# Altium project Motherboard.PrjPcb
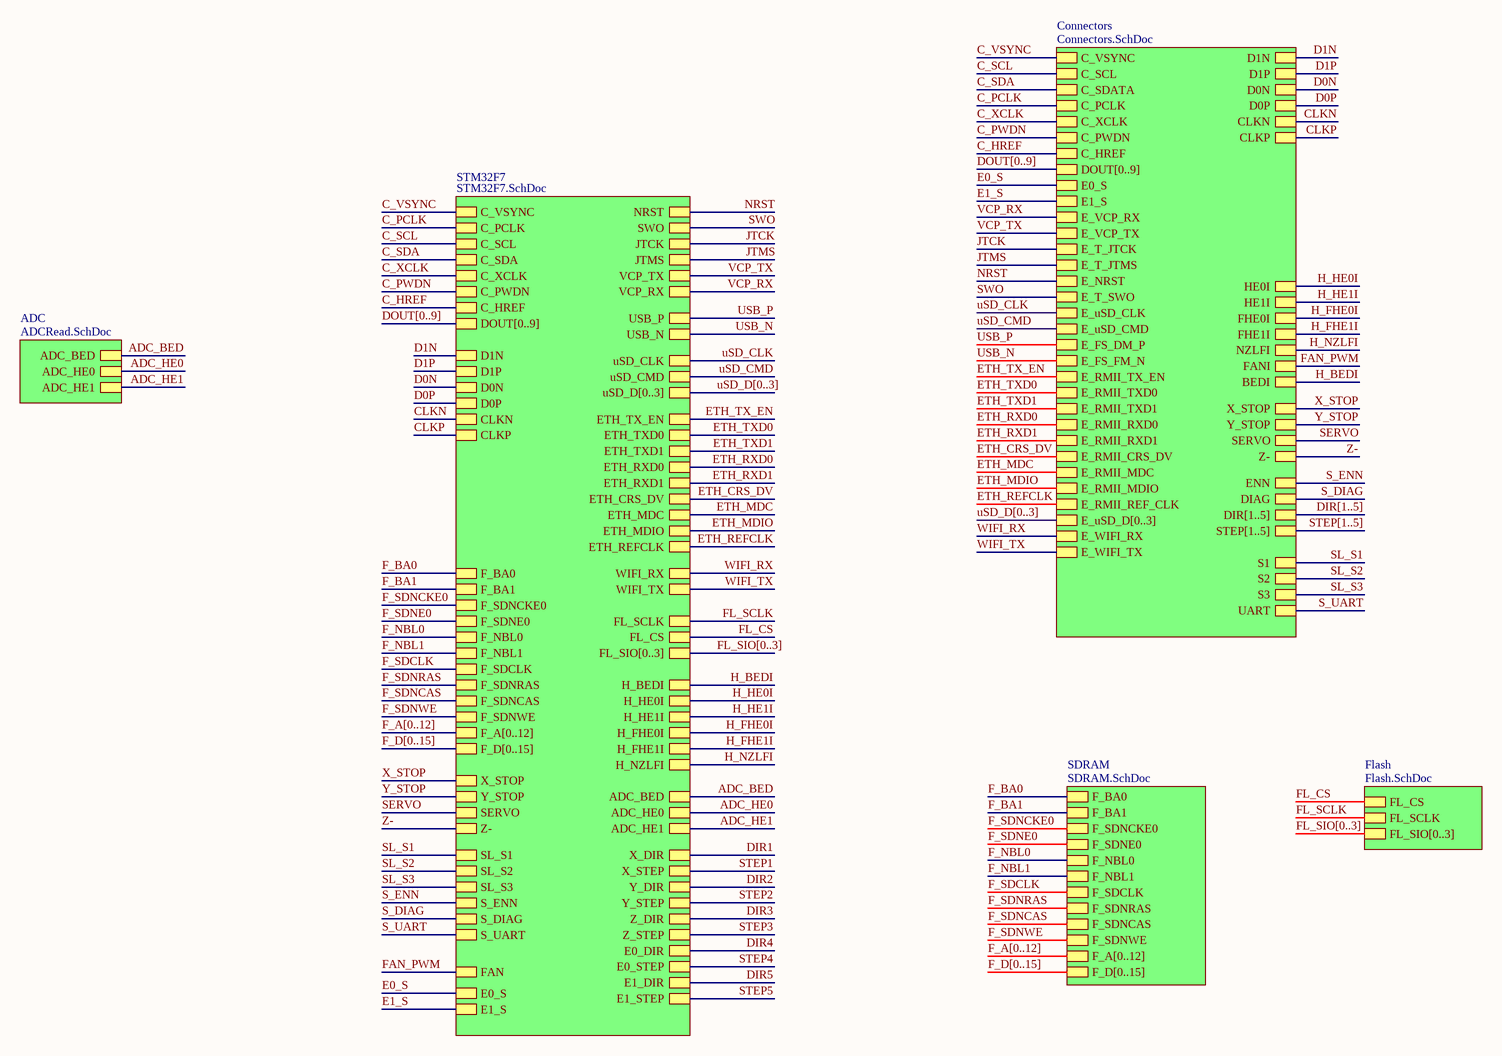
[diagram p0: Motherboard.SchDoc]
6 sheets, 89 parts. Net scope: hierarchical (ports join the sheet entries above them; power ports are global).
Sheets:
  Motherboard.SchDoc
    Connectors = Connectors.SchDoc
    STM32F7 = STM32F7.SchDoc
    SDRAM = SDRAM.SchDoc
    Flash = Flash.SchDoc
    ADC = ADCRead.SchDoc

## Sheet Motherboard.SchDoc
size B

### Sub-sheets
ADC = ADCRead.SchDoc: ADC_BED, ADC_HE0, ADC_HE1
Connectors = Connectors.SchDoc: C_VSYNC, C_SCL, C_SDATA, C_PCLK, C_XCLK, C_PWDN, C_HREF, DOUT[0..9], E_VCP_RX, E_VCP_TX, E_T_JTCK, E_T_JTMS, E_NRST, E_T_SWO, E_uSD_CLK, E_uSD_CMD, E_FS_DM_P, E_FS_FM_N, E_RMII_TX_EN, E_RMII_TXD0, E_RMII_TXD1, E_RMII_RXD0, E_RMII_RXD1, E_RMII_CRS_DV, E_RMII_MDC, E_RMII_MDIO, E_RMII_REF_CLK, E_uSD_D[0..3], E_WIFI_RX, E_WIFI_TX, X_STOP, Y_STOP, SERVO, Z-, E0_S, E1_S, BEDI, FANI, FHE1I, HE1I, FHE0I, NZLFI, HE0I, ENN, STEP[1..5], DIR[1..5], DIAG, UART, S1, S2, S3, D1N, D1P, D0N, D0P, CLKN, CLKP
Flash = Flash.SchDoc: FL_CS, FL_SCLK, FL_SIO[0..3]
SDRAM = SDRAM.SchDoc: F_BA0, F_BA1, F_SDNCKE0, F_SDNE0, F_NBL0, F_NBL1, F_SDCLK, F_SDNRAS, F_SDNCAS, F_SDNWE, F_A[0..12], F_D[0..15]
STM32F7 = STM32F7.SchDoc: NRST, SWO, JTCK, JTMS, VCP_TX, VCP_RX, USB_P, USB_N, uSD_CLK, uSD_CMD, uSD_D[0..3], ETH_TX_EN, ETH_TXD0, ETH_TXD1, ETH_RXD0, ETH_RXD1, ETH_CRS_DV, ETH_MDC, ETH_MDIO, ETH_REFCLK, WIFI_RX, WIFI_TX, C_VSYNC, C_PCLK, C_SCL, C_SDA, C_XCLK, C_PWDN, C_HREF, DOUT[0..9], F_BA0, F_BA1, F_SDNCKE0, F_SDNE0, F_NBL0, F_NBL1, F_SDCLK, F_SDNRAS, F_SDNCAS, F_SDNWE, F_A[0..12], F_D[0..15], FL_SCLK, FL_CS, FL_SIO[0..3], H_BEDI, H_HE0I, H_HE1I, H_FHE0I, H_FHE1I, H_NZLFI, ADC_BED, ADC_HE0, ADC_HE1, X_STOP, Y_STOP, SERVO, Z-, SL_S1, SL_S2, SL_S3, S_ENN, S_DIAG, S_UART, X_DIR, X_STEP, Y_DIR, Y_STEP, Z_DIR, Z_STEP, E0_DIR, E0_STEP, E1_DIR, E1_STEP, FAN, E0_S, E1_S, D1N, D1P, D0N, D0P, CLKN, CLKP

### Nets
ADC_BED: sheet STM32F7/ADC_BED, sheet ADC/ADC_BED
ADC_HE0: sheet STM32F7/ADC_HE0, sheet ADC/ADC_HE0
ADC_HE1: sheet STM32F7/ADC_HE1, sheet ADC/ADC_HE1
C_HREF: sheet Connectors/C_HREF, sheet STM32F7/C_HREF
C_PCLK: sheet Connectors/C_PCLK, sheet STM32F7/C_PCLK
C_PWDN: sheet Connectors/C_PWDN, sheet STM32F7/C_PWDN
C_SCL: sheet Connectors/C_SCL, sheet STM32F7/C_SCL
C_SDA: sheet Connectors/C_SDATA, sheet STM32F7/C_SDA
C_VSYNC: sheet Connectors/C_VSYNC, sheet STM32F7/C_VSYNC
C_XCLK: sheet Connectors/C_XCLK, sheet STM32F7/C_XCLK
CLKN: sheet Connectors/CLKN, sheet STM32F7/CLKN
CLKP: sheet Connectors/CLKP, sheet STM32F7/CLKP
D0N: sheet Connectors/D0N, sheet STM32F7/D0N
D0P: sheet Connectors/D0P, sheet STM32F7/D0P
D1N: sheet Connectors/D1N, sheet STM32F7/D1N
D1P: sheet Connectors/D1P, sheet STM32F7/D1P
E0_S: sheet Connectors/E0_S, sheet STM32F7/E0_S
E1_S: sheet Connectors/E1_S, sheet STM32F7/E1_S
ETH_CRS_DV: sheet Connectors/E_RMII_CRS_DV, sheet STM32F7/ETH_CRS_DV
ETH_MDC: sheet Connectors/E_RMII_MDC, sheet STM32F7/ETH_MDC
ETH_MDIO: sheet Connectors/E_RMII_MDIO, sheet STM32F7/ETH_MDIO
ETH_REFCLK: sheet Connectors/E_RMII_REF_CLK, sheet STM32F7/ETH_REFCLK
ETH_RXD0: sheet Connectors/E_RMII_RXD0, sheet STM32F7/ETH_RXD0
ETH_RXD1: sheet Connectors/E_RMII_RXD1, sheet STM32F7/ETH_RXD1
ETH_TX_EN: sheet Connectors/E_RMII_TX_EN, sheet STM32F7/ETH_TX_EN
ETH_TXD0: sheet Connectors/E_RMII_TXD0, sheet STM32F7/ETH_TXD0
ETH_TXD1: sheet Connectors/E_RMII_TXD1, sheet STM32F7/ETH_TXD1
F_BA0: sheet STM32F7/F_BA0, sheet SDRAM/F_BA0
F_BA1: sheet STM32F7/F_BA1, sheet SDRAM/F_BA1
F_NBL0: sheet STM32F7/F_NBL0, sheet SDRAM/F_NBL0
F_NBL1: sheet STM32F7/F_NBL1, sheet SDRAM/F_NBL1
F_SDCLK: sheet STM32F7/F_SDCLK, sheet SDRAM/F_SDCLK
F_SDNCAS: sheet STM32F7/F_SDNCAS, sheet SDRAM/F_SDNCAS
F_SDNCKE0: sheet STM32F7/F_SDNCKE0, sheet SDRAM/F_SDNCKE0
F_SDNE0: sheet STM32F7/F_SDNE0, sheet SDRAM/F_SDNE0
F_SDNRAS: sheet STM32F7/F_SDNRAS, sheet SDRAM/F_SDNRAS
F_SDNWE: sheet STM32F7/F_SDNWE, sheet SDRAM/F_SDNWE
FAN_PWM: sheet Connectors/FANI, sheet STM32F7/FAN
FL_CS: sheet STM32F7/FL_CS, sheet Flash/FL_CS  [project net CS]
FL_SCLK: sheet STM32F7/FL_SCLK, sheet Flash/FL_SCLK
H_BEDI: sheet Connectors/BEDI, sheet STM32F7/H_BEDI
H_FHE0I: sheet Connectors/FHE0I, sheet STM32F7/H_FHE0I
H_FHE1I: sheet Connectors/FHE1I, sheet STM32F7/H_FHE1I
H_HE0I: sheet Connectors/HE0I, sheet STM32F7/H_HE0I
H_HE1I: sheet Connectors/HE1I, sheet STM32F7/H_HE1I
H_NZLFI: sheet Connectors/NZLFI, sheet STM32F7/H_NZLFI
JTCK: sheet Connectors/E_T_JTCK, sheet STM32F7/JTCK
JTMS: sheet Connectors/E_T_JTMS, sheet STM32F7/JTMS
NRST: sheet Connectors/E_NRST, sheet STM32F7/NRST
S_DIAG: sheet Connectors/DIAG, sheet STM32F7/S_DIAG
S_ENN: sheet Connectors/ENN, sheet STM32F7/S_ENN
S_UART: sheet Connectors/UART, sheet STM32F7/S_UART
SERVO: sheet Connectors/SERVO, sheet STM32F7/SERVO
SL_S1: sheet Connectors/S1, sheet STM32F7/SL_S1
SL_S2: sheet Connectors/S2, sheet STM32F7/SL_S2
SL_S3: sheet Connectors/S3, sheet STM32F7/SL_S3
SWO: sheet Connectors/E_T_SWO, sheet STM32F7/SWO
USB_N: sheet Connectors/E_FS_FM_N, sheet STM32F7/USB_N  [project net FS_DM_N]
USB_P: sheet Connectors/E_FS_DM_P, sheet STM32F7/USB_P  [project net FS_DM_P]
uSD_CLK: sheet Connectors/E_uSD_CLK, sheet STM32F7/uSD_CLK
uSD_CMD: sheet Connectors/E_uSD_CMD, sheet STM32F7/uSD_CMD
VCP_RX: sheet Connectors/E_VCP_RX, sheet STM32F7/VCP_RX  [project net USART1_RX]
VCP_TX: sheet Connectors/E_VCP_TX, sheet STM32F7/VCP_TX  [project net USART1_TX]
WIFI_RX: sheet Connectors/E_WIFI_RX, sheet STM32F7/WIFI_RX
WIFI_TX: sheet Connectors/E_WIFI_TX, sheet STM32F7/WIFI_TX
X_STOP: sheet Connectors/X_STOP, sheet STM32F7/X_STOP
Y_STOP: sheet Connectors/Y_STOP, sheet STM32F7/Y_STOP
Z-: sheet Connectors/Z-, sheet STM32F7/Z-

### Buses and harness runs
bus DIR[1..5] = sheet Connectors/DIR[1..5]
bus DOUT[0..9] = sheet Connectors/DOUT[0..9]
bus DOUT[0..9] = sheet STM32F7/DOUT[0..9]
bus F_A[0..12] = sheet SDRAM/F_A[0..12]
bus F_A[0..12] = sheet STM32F7/F_A[0..12]
bus F_D[0..15] = sheet SDRAM/F_D[0..15]
bus F_D[0..15] = sheet STM32F7/F_D[0..15]
bus FL_SIO[0..3] = sheet Flash/FL_SIO[0..3]
bus FL_SIO[0..3] = sheet STM32F7/FL_SIO[0..3]
bus STEP[1..5] = sheet Connectors/STEP[1..5]
bus uSD_D[0..3] = sheet Connectors/E_uSD_D[0..3]
bus uSD_D[0..3] = sheet STM32F7/uSD_D[0..3]

## Sheet Connectors.SchDoc
size B
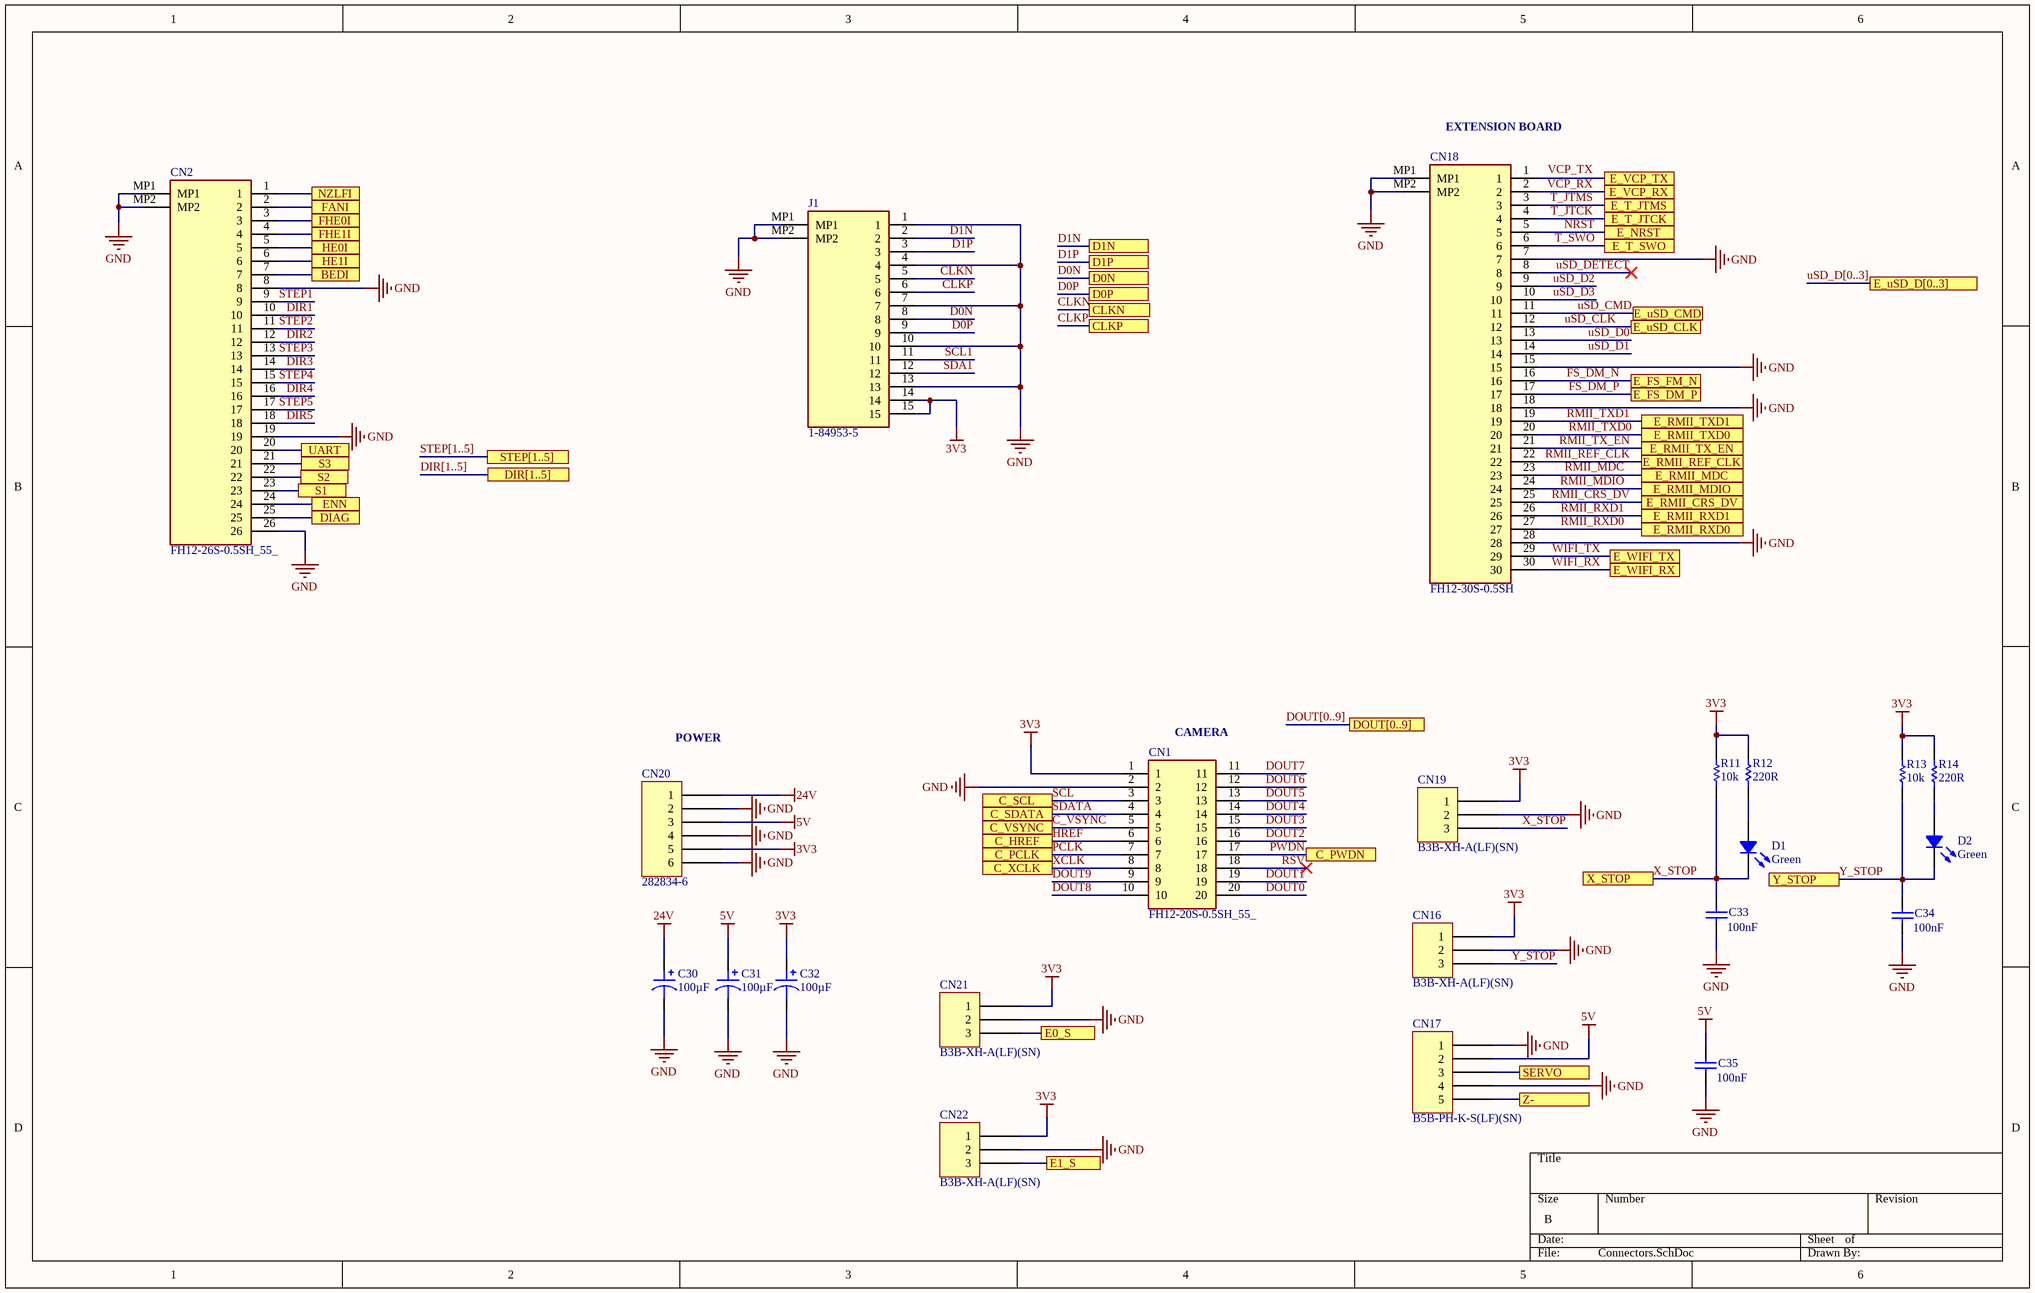
[diagram p1: Connectors.SchDoc]

### Parts
C30  100µF  [CAP ALSMD POLY 5.3MM H6.0MM]
C31  100µF  [CAP ALSMD POLY 5.3MM H6.0MM]
C32  100µF  [CAP ALSMD POLY 5.3MM H6.0MM]
C33  value 100nF  [1608[0603]]  (hidden comment: X5R)
C34  value 100nF  [1608[0603]]  (hidden comment: X5R)
C35  value 100nF  [1608[0603]]  (hidden comment: X5R)
CN1  FH12-20S-0.5SH_55_  [FH12-20S-0.5SH(55)]
CN2  FH12-26S-0.5SH_55_  [FH1226S05SH55]
CN16  B3B-XH-A(LF)(SN)  [JST XH B3B-XH-A]
CN17  B5B-PH-K-S(LF)(SN)  [JST B5B-PH-K]
CN18  FH12-30S-0.5SH  [FH1230S05SH]
CN19  B3B-XH-A(LF)(SN)  [JST XH B3B-XH-A]
CN20  282834-6  [TE 282834-6]
CN21  B3B-XH-A(LF)(SN)  [JST XH B3B-XH-A]
CN22  B3B-XH-A(LF)(SN)  [JST XH B3B-XH-A]
D1  Green  [LED 0805_2012 GREEN]
D2  Green  [LED 0805_2012 GREEN]
J1  1-84953-5  [1849535]
R11  value 10k  [1608[0603]]  (hidden comment: Res1)
R12  value 220R  [1608[0603]]  (hidden comment: Res1)
R13  value 10k  [1608[0603]]  (hidden comment: Res1)
R14  value 220R  [1608[0603]]  (hidden comment: Res1)

### Ports
BEDI, C_HREF, C_PCLK, C_PWDN, C_SCL, C_SDATA, C_VSYNC, C_XCLK, CLKN, CLKP, D0N, D0P, D1N, D1P, DIAG, DIR[1..5], DOUT[0..9], E0_S, E1_S, E_FS_DM_P, E_FS_FM_N, E_NRST, E_RMII_CRS_DV, E_RMII_MDC, E_RMII_MDIO, E_RMII_REF_CLK, E_RMII_RXD0, E_RMII_RXD1, E_RMII_TX_EN, E_RMII_TXD0, E_RMII_TXD1, E_T_JTCK, E_T_JTMS, E_T_SWO, E_uSD_CLK, E_uSD_CMD, E_uSD_D[0..3], E_VCP_RX, E_VCP_TX, E_WIFI_RX, E_WIFI_TX, ENN, FANI, FHE0I, FHE1I, HE0I, HE1I, NZLFI, S1, S2, S3, SERVO, STEP[1..5], UART, X_STOP, Y_STOP, Z-

### Nets
3V3: C32.1 CN1.1 CN16.1 CN19.1 CN20.5 CN21.1 CN22.1 J1.14 J1.15 R11.1 R12.1 R13.1 R14.1
5V: C31.1 C35.1 CN17.2 CN20.3
24V: C30.1 CN20.1
GND: C30.2 C31.2 C32.2 C33.2 C34.2 C35.2 CN1.2 CN2.8 CN2.19 CN2.26 CN2.MP1 CN2.MP2 CN16.2 CN17.1 CN17.4 CN18.7 CN18.15 CN18.18 CN18.28 CN18.MP1 CN18.MP2 CN19.2 CN20.2 CN20.4 CN20.6 CN21.2 CN22.2 J1.1 J1.4 J1.7 J1.10 J1.13 J1.MP1 J1.MP2
C_VSYNC: CN1.5 ; port C_VSYNC
CLKN: J1.5 ; port CLKN
CLKP: J1.6 ; port CLKP
D0N: J1.8 ; port D0N
D0P: J1.9 ; port D0P
D1N: J1.2 ; port D1N
D1P: J1.3 ; port D1P
DIR1: CN2.10
DIR2: CN2.12
DIR3: CN2.14
DIR4: CN2.16
DIR5: CN2.18
DOUT0: CN1.20
DOUT1: CN1.19
DOUT2: CN1.16
DOUT3: CN1.15
DOUT4: CN1.14
DOUT5: CN1.13
DOUT6: CN1.12
DOUT7: CN1.11
DOUT8: CN1.10
DOUT9: CN1.9
E0_S: CN21.3 ; port E0_S
E1_S: CN22.3 ; port E1_S
ETH_MDC: CN18.23 ; port E_RMII_MDC
FAN_PWM: CN2.2 ; port FANI
FS_DM_N: CN18.16 ; port E_FS_FM_N
FS_DM_P: CN18.17 ; port E_FS_DM_P
H_BEDI: CN2.7 ; port BEDI
H_FHE0I: CN2.3 ; port FHE0I
H_FHE1I: CN2.4 ; port FHE1I
H_HE0I: CN2.5 ; port HE0I
H_HE1I: CN2.6 ; port HE1I
H_NZLFI: CN2.1 ; port NZLFI
HREF: CN1.6 ; port C_HREF  [project net C_HREF]
NRST: CN18.5 ; port E_NRST
PCLK: CN1.7 ; port C_PCLK  [project net C_PCLK]
PWDN: CN1.17 ; port C_PWDN  [project net C_PWDN]
RMII_CRS_DV: CN18.25 ; port E_RMII_CRS_DV  [project net ETH_CRS_DV]
RMII_MDIO: CN18.24 ; port E_RMII_MDIO  [project net ETH_MDIO]
RMII_REF_CLK: CN18.22 ; port E_RMII_REF_CLK  [project net ETH_REFCLK]
RMII_RXD0: CN18.27 ; port E_RMII_RXD0  [project net ETH_RXD0]
RMII_RXD1: CN18.26 ; port E_RMII_RXD1  [project net ETH_RXD1]
RMII_TX_EN: CN18.21 ; port E_RMII_TX_EN  [project net ETH_TX_EN]
RMII_TXD0: CN18.20 ; port E_RMII_TXD0  [project net ETH_TXD0]
RMII_TXD1: CN18.19 ; port E_RMII_TXD1  [project net ETH_TXD1]
RSV: CN1.18
S_DIAG: CN2.25 ; port DIAG
S_ENN: CN2.24 ; port ENN
S_UART: CN2.20 ; port UART
SCL: CN1.3 ; port C_SCL  [project net C_SCL]
SCL1: J1.11
SDA1: J1.12
SDATA: CN1.4 ; port C_SDATA  [project net C_SDA]
SERVO: CN17.3 ; port SERVO
SL_S1: CN2.23 ; port S1
SL_S2: CN2.22 ; port S2
SL_S3: CN2.21 ; port S3
STEP1: CN2.9
STEP2: CN2.11
STEP3: CN2.13
STEP4: CN2.15  [project net E0_STEP]
STEP5: CN2.17  [project net E1_STEP]
T_JTCK: CN18.4 ; port E_T_JTCK  [project net JTCK]
T_JTMS: CN18.3 ; port E_T_JTMS  [project net JTMS]
T_SWO: CN18.6 ; port E_T_SWO  [project net SWO]
USART1_TX: CN18.1 ; port E_VCP_TX
uSD_CLK: CN18.12 ; port E_uSD_CLK
uSD_CMD: CN18.11 ; port E_uSD_CMD
uSD_D0: CN18.13
uSD_D1: CN18.14
uSD_D2: CN18.9
uSD_D3: CN18.10
uSD_DETECT: CN18.8
VCP_RX: CN18.2 ; port E_VCP_RX  [project net USART1_RX]
WIFI_RX: CN18.30 ; port E_WIFI_RX
WIFI_TX: CN18.29 ; port E_WIFI_TX
X_STOP: C33.1 CN19.3 D1.2 R11.2 ; port X_STOP
XCLK: CN1.8 ; port C_XCLK  [project net C_XCLK]
Y_STOP: C34.1 CN16.3 D2.2 R13.2 ; port Y_STOP
Z-: CN17.5 ; port Z-
NetD1_1: D1.1 R12.2
NetD2_1: D2.1 R14.2

### Buses and harness runs
bus DIR[1..5] = port DIR[1..5]
bus DOUT[0..9] = port DOUT[0..9]
bus STEP[1..5] = port STEP[1..5]
bus uSD_D[0..3] = port E_uSD_D[0..3]

### Notes on the sheet
- (near CN18) EXTENSION BOARD
- (near CN20) POWER
- (near CN1) CAMERA
- Labels drawn without touching a wire or pin: RMII_MDC, VCP_TX

### Library data of the parts
C30-C32 = 6SVPC100M: CAP ALUM POLY 100UF 20% 6.3V SMD; manufacturer: Panasonic Electronic Components; ESR (Equivalent Series Resistance): 30mOhm; Lifetime @ Temp.: 2000 Hrs @ 105°C; Ripple Current @ High Frequency: 2.15A @ 100kHz; Ripple Current @ Low Frequency: 107.5mA @ 120Hz; Surface Mount Land Size: 0.209" L x 0.209" W (5.30mm x 5.30mm); Type: Polymer; Part Number: 6SVPC100M; Applications: General Purpose; Capacitance: 100µF; componentlink1description: Datasheet; componentlink1url: https://industrial.panasonic.com/cdbs/www-data/pdf/AAB8000/AAB8000C256.pdf; componentlink2description: DigiKey Link; componentlink2url: http://digikey.com/product-detail/en/panasonic-electronic-components/6SVPC100M/P16606CT-ND/4204442; Device Package: Radial, Can - SMD; Height - Seated (Max): 0.236" (6.00mm); lastupdated: 9/2/2020 1:22:07 AM; Lifecycle Status: Active; Minimum Order: 1; Mounting Type: Surface Mount; Operating Temperature: -55°C ~ 105°C; Package / Case: Radial, Can - SMD; packaging: TapeAndReel; partid: 1943; Part Status: Active; price: 0.51; series: OS-CON™, SVPC; Size / Dimension: 0.197" Dia (5.00mm); Supplier 1: DigiKey; Supplier Part Number 1: P16606CT-ND; Tolerance: ±20%; value: 100µF; Voltage - Rated: 6.3V
C33-C35 = Cap: Capacitor; Published: 8-Jun-2000; LatestRevisionDate: 17-Jul-2002; LatestRevisionNote: Re-released for DXP Platform.; PackageReference: RAD-0.3; Publisher: Altium Limited; PackageDescription: Radial Cap, Thru-Hole; 2 Leads; 0.3 in Pin Spacing
CN1 = FH12-20S-0.5SH_55_: Connector; Manufacturer_Name: Hirose; Datasheet Link: https://componentsearchengine.com/Datasheets/2/FH12-20S-0.5SH(55).pdf; Manufacturer_Part_Number: FH12-20S-0.5SH(55); Mouser Part Number: 798-FH12-20S-0.5SH55; Mouser Price/Stock: https://www.mouser.co.uk/ProductDetail/Hirose-Connector/FH12-20S-0.5SH55?qs=Ux3WWAnHpjBAoMH%252Bjl1N9Q%3D%3D
CN2 = FH12-26S-0.5SH_55_: Connector; Manufacturer_Name: Hirose; Manufacturer_Part_Number: FH12-26S-0.5SH(55); Datasheet Link: https://datasheet.datasheetarchive.com/originals/distributors/SFDatasheet-1/sf-00023459.pdf; Height: 2.2mm; Mouser Part Number: 798-FH12-26S-0.5SH55; Mouser Price/Stock: https://www.mouser.co.uk/ProductDetail/Hirose-Connector/FH12-26S-0.5SH55?qs=Ux3WWAnHpjC%2FipJJsmJDaQ%3D%3D; Arrow Part Number: FH12-26S-0.5SH(55); Arrow Price/Stock: https://www.arrow.com/en/products/fh12-26s-0.5sh-55/hirose-electric
CN16 CN19 CN21 CN22 = B3B-XH-A(LF)(SN): CONN HEADER VERT 3POS 2.5MM; Manufacturer: JST Sales America Inc.; Contact Length - Post: 0.134" (3.40mm); Current Rating (Amps): 3A; Material Flammability Rating: UL94 V-0; Number of Positions: 3; Number of Positions Loaded: All; Pitch - Mating: 0.098" (2.50mm); Shrouding: Shrouded - 4 Wall; Style: Board to Cable/Wire; Voltage Rating: 250V; Part Number: B3B-XH-A(LF)(SN); ComponentLink1Description: Datasheet; ComponentLink1URL: http://www.jst-mfg.com/product/pdf/eng/eXH.pdf; ComponentLink2Description: DigiKey Link; ComponentLink2URL: http://digikey.com/product-detail/en/jst-sales-america-inc/B3B-XH-A-LF-SN/455-2248-ND/1651046; Connector Type: Header; Contact Finish - Mating: Tin; Contact Finish - Post: Tin; Contact Material: Brass; Contact Shape: Square; Contact Type: Male Pin; Fastening Type: Detent Lock; Insulation Color: Natural; Insulation Height: 0.276" (7.00mm); Insulation Material: Polyamide (PA66), Nylon 6/6; LastUpdated: 1/12/2020 11:46:22 PM; Lifecycle Status: Active; Minimum Order: 1; Mounting Type: Through Hole; Number of Rows: 1; Operating Temperature: -25°C ~ 85°C; Packaging: Bulk; PartId: 68; Part Status: Active; Price: 0.19; Series: XH; Supplier 1: DigiKey; Supplier Part Number 1: 455-2248-ND; Termination: Press-Fit, Solder
CN17 = B5B-PH-K-S(LF)(SN): CONN HEADER VERT 5POS 2MM; Manufacturer: JST Sales America Inc.; Contact Length - Mating: 0.130" (3.30mm); Contact Length - Post: 0.134" (3.40mm); Current Rating (Amps): 2A; Material Flammability Rating: UL94 V-0; Number of Positions: 5; Number of Positions Loaded: All; Overall Contact Length: 0.333" (8.45mm); Pitch - Mating: 0.079" (2.00mm); Shrouding: Shrouded - 4 Wall; Style: Board to Cable/Wire; Voltage Rating: 100V; Part Number: B5B-PH-K-S(LF)(SN); ComponentLink1Description: Datasheet; ComponentLink1URL: http://www.jst-mfg.com/product/pdf/eng/ePH.pdf; ComponentLink2Description: DigiKey Link; ComponentLink2URL: http://digikey.com/product-detail/en/jst-sales-america-inc/B5B-PH-K-S-LF-SN/455-1707-ND/926614; Connector Type: Header; Contact Finish - Mating: Tin; Contact Finish - Post: Tin; Contact Material: Brass; Contact Shape: Square; Contact Type: Male Pin; Fastening Type: Detent Lock; Insulation Color: Natural; Insulation Height: 0.236" (6.00mm); Insulation Material: Polyamide (PA66), Nylon 6/6; LastUpdated: 1/12/2020 10:30:05 PM; Lifecycle Status: Active; Minimum Order: 1; Mounting Type: Through Hole; Number of Rows: 1; Operating Temperature: -25°C ~ 85°C; Packaging: Bulk; PartId: 28; Part Status: Active; Price: 0.29; Series: PH; Supplier 1: DigiKey; Supplier Part Number 1: 455-1707-ND; Termination: Press-Fit, Solder
CN18 = FH12-30S-0.5SH: Connector; Manufacturer_Name: Hirose; Datasheet Link: https://datasheet.datasheetarchive.com/originals/dk/DKDS-2/23451.pdf; Height: 4.8mm; Manufacturer_Part_Number: FH12-30S-0.5SH
CN20 = 282834-6: TERM BLK 6P SIDE ENT 2.54MM PCB; Manufacturer: TE Connectivity AMP Connectors; Current: 10A; Mating Orientation: Horizontal with Board; Number of Levels: 1; Pitch: 0.100" (2.54mm); Positions Per Level: 6; Voltage: 150V; Wire Gauge: 16-30 AWG; Wire Termination: Screw - Rising Cage Clamp; Part Number: 282834-6; Color: Green; ComponentLink1Description: Datasheet; ComponentLink1URL: https://www.te.com/commerce/DocumentDelivery/DDEController?Action=srchrtrv&DocNm=282834&DocType=Customer+Drawing&DocLang=English; ComponentLink2Description: DigiKey Link; ComponentLink2URL: http://digikey.com/product-detail/en/te-connectivity-amp-connectors/282834-6/A98337-ND/1153267; LastUpdated: 1/15/2020 4:16:31 AM; Lifecycle Status: Active; Minimum Order: 1; Mounting Type: Through Hole; Packaging: Bulk; Part Status: Active; Price: 4.72; Series: Buchanan; Supplier 1: DigiKey; Supplier Part Number 1: A98337-ND
D1 D2 = QTLP630C4TR: LED GREEN CLEAR 0805 SMD; Manufacturer: Everlight Electronics Co Ltd; Configuration: Standard; Current - Test: 20mA; Lens Color: Colorless; Lens Size: 1.40mm x 1.25mm; Lens Style: Rectangle with Flat Top; Millicandela Rating: 10mcd; Viewing Angle: 140°; Voltage - Forward (Vf) (Typ): 2.1V; Wavelength - Dominant: 570nm; Wavelength - Peak: 565nm; Part Number: QTLP630C4TR; Color: Green; ComponentLink1Description: Datasheet; ComponentLink1URL: //media.digikey.com/PDF/Data%20Sheets/Everlight%20PDFs/QTLP630-2.pdf; ComponentLink2Description: DigiKey Link; ComponentLink2URL: https://www.digikey.com/en/products/detail/everlight-electronics-co-ltd/QTLP630C4TR/2675902; Device Package: 0805 (2012 Metric); Height (Max): 1.20mm; LastUpdated: 3/28/2023 7:59:32 PM; Lens Transparency: Clear; Lifecycle Status: Active; Minimum Order: 1; Mounting Type: Surface Mount; Package / Case: 0805 (2012 Metric); Packaging: TapeAndReel; PartId: 240; Part Status: Active; Price: 0.04; Series: -; Size / Dimension: 2.00mm L x 1.25mm W; Supplier 1: DigiKey; Supplier Part Number 1: 1080-1411-1-ND; Supplier Device Package: 0805; Value: Green
J1 = 1-84953-5: Connector; Manufacturer_Name: TE Connectivity; Datasheet Link: https://www.te.com/commerce/DocumentDelivery/DDEController?Action=showdoc&DocId=Customer+Drawing%7F84953%7FA3%7Fpdf%7FEnglish%7FENG_CD_84953_A3.pdf%7F1-84953-5; Height: 2.74mm; Manufacturer_Part_Number: 1-84953-5; Mouser Part Number: 571-1-84953-5; Mouser Price/Stock: https://www.mouser.co.uk/ProductDetail/TE-Connectivity/1-84953-5?qs=uUkeXfjQ8uS9OOvsO8VIHg%3D%3D; Arrow Part Number: 1-84953-5; Arrow Price/Stock: https://www.arrow.com/en/products/1-84953-5/te-connectivity?region=nac
R11-R14 = Res1: Resistor; Published: 8-Jun-2000; LatestRevisionDate: 17-Jul-2002; LatestRevisionNote: Re-released for DXP Platform.; PackageReference: AXIAL-0.3; Publisher: Altium Limited; PackageDescription: Axial Device, Thru-Hole; 2 Leads; 0.3 in Pin Spacing

## Sheet STM32F7.SchDoc
size C
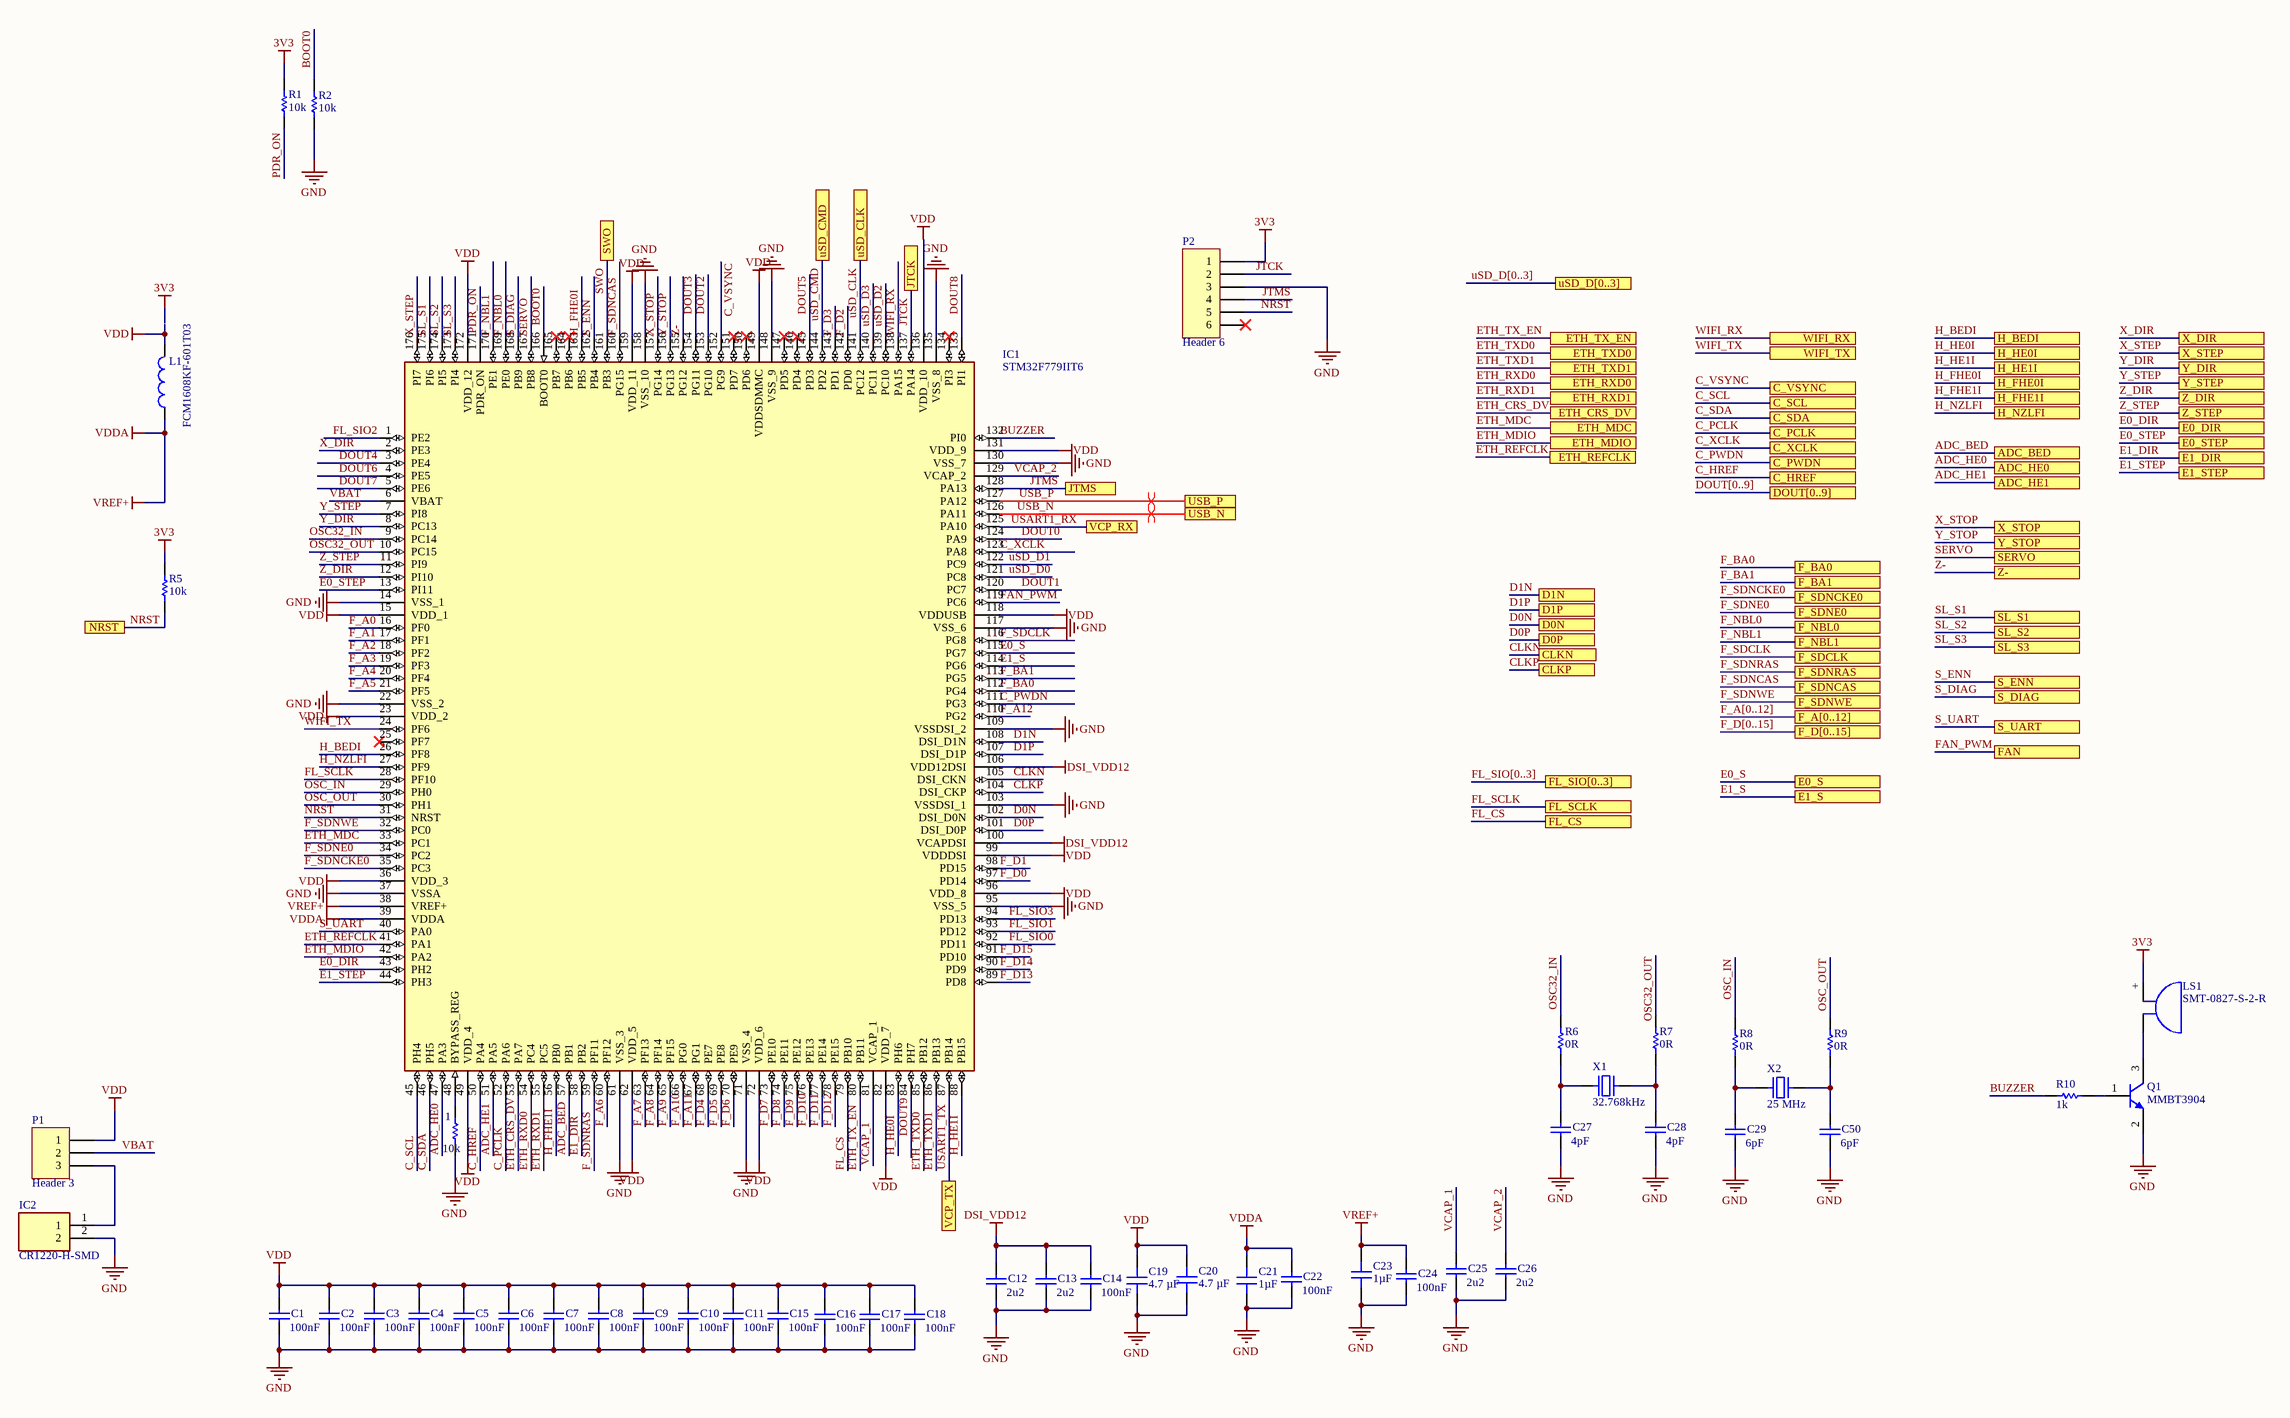
[diagram p2: STM32F7.SchDoc]

### Parts
1  value 10k  [1608[0603]]  (hidden comment: Res1)
C1  value 100nF  [1608[0603]]  (hidden comment: X5R)
C2  value 100nF  [1608[0603]]  (hidden comment: X5R)
C3  value 100nF  [1608[0603]]  (hidden comment: X5R)
C4  value 100nF  [1608[0603]]  (hidden comment: X5R)
C5  value 100nF  [1608[0603]]  (hidden comment: X5R)
C6  value 100nF  [1608[0603]]  (hidden comment: X5R)
C7  value 100nF  [1608[0603]]  (hidden comment: X5R)
C8  value 100nF  [1608[0603]]  (hidden comment: X5R)
C9  value 100nF  [1608[0603]]  (hidden comment: X5R)
C10  value 100nF  [1608[0603]]  (hidden comment: X5R)
C11  value 100nF  [1608[0603]]  (hidden comment: X5R)
C12  value 2u2  [1608[0603]]  (hidden comment: X5R)
C13  value 2u2  [1608[0603]]  (hidden comment: X5R)
C14  value 100nF  [1608[0603]]  (hidden comment: X5R)
C15  value 100nF  [1608[0603]]  (hidden comment: X5R)
C16  value 100nF  [1608[0603]]  (hidden comment: X5R)
C17  value 100nF  [1608[0603]]  (hidden comment: X5R)
C18  value 100nF  [1608[0603]]  (hidden comment: X5R)
C19  4.7 µF  [CAP 0603_1608]
C20  4.7 µF  [CAP 0603_1608]
C21  1µF  [CAP 0603_1608]
C22  value 100nF  [1608[0603]]  (hidden comment: X5R)
C23  1µF  [CAP 0603_1608]
C24  value 100nF  [1608[0603]]  (hidden comment: X5R)
C25  value 2u2  [1608[0603]]  (hidden comment: X5R)
C26  value 2u2  [1608[0603]]  (hidden comment: X5R)
C27  value 4pF  [1608[0603]]  (hidden comment: X5R)
C28  value 4pF  [1608[0603]]  (hidden comment: X5R)
C29  value 6pF  [1608[0603]]  (hidden comment: X5R)
C50  value 6pF  [1608[0603]]  (hidden comment: X5R)
IC1  STM32F779IIT6  [QFP50P2600X2600X160-176N]
IC2  CR1220-H-SMD  [CR1220HSMD]
L1  FCM1608KF-601T03  [0603L]
LS1  SMT-0827-S-2-R  [PUI Audio SMT-0827-S-2-R]
P1  Header 3  [HDR1X3]
P2  Header 6  [HDR1X6]
Q1  MMBT3904  [SOT-23_N]
R1  value 10k  [1608[0603]]  (hidden comment: Res1)
R2  value 10k  [1608[0603]]  (hidden comment: Res1)
R5  value 10k  [1608[0603]]  (hidden comment: Res1)
R6  value 0R  [1608[0603]]  (hidden comment: Res1)
R7  value 0R  [1608[0603]]  (hidden comment: Res1)
R8  value 0R  [1608[0603]]  (hidden comment: Res1)
R9  value 0R  [1608[0603]]  (hidden comment: Res1)
R10  value 1k  [1608[0603]]  (hidden comment: Res1)
X1  32.768kHz  [NDK NX5032GA]
X2  25 MHz  [NDK NX5032GA]

### Ports
ADC_BED, ADC_HE0, ADC_HE1, C_HREF, C_PCLK, C_PWDN, C_SCL, C_SDA, C_VSYNC, C_XCLK, CLKN, CLKP, D0N, D0P, D1N, D1P, DOUT[0..9], E0_DIR, E0_S, E0_STEP, E1_DIR, E1_S, E1_STEP, ETH_CRS_DV, ETH_MDC, ETH_MDIO, ETH_REFCLK, ETH_RXD0, ETH_RXD1, ETH_TX_EN, ETH_TXD0, ETH_TXD1, F_A[0..12], F_BA0, F_BA1, F_D[0..15], F_NBL0, F_NBL1, F_SDCLK, F_SDNCAS, F_SDNCKE0, F_SDNE0, F_SDNRAS, F_SDNWE, FAN, FL_CS, FL_SCLK, FL_SIO[0..3], H_BEDI, H_FHE0I, H_FHE1I, H_HE0I, H_HE1I, H_NZLFI, JTCK, JTMS, NRST, S_DIAG, S_ENN, S_UART, SERVO, SL_S1, SL_S2, SL_S3, SWO, USB_N, USB_P, uSD_CLK, uSD_CMD, uSD_D[0..3], VCP_RX, VCP_TX, WIFI_RX, WIFI_TX, X_DIR, X_STEP, X_STOP, Y_DIR, Y_STEP, Y_STOP, Z-, Z_DIR, Z_STEP

### Nets
3V3: LS1.+ P2.1 R1.1 R5.1
DSI_VDD12: C12.1 C13.1 C14.1 IC1.100(VCAPDSI) IC1.106(VDD12DSI)
GND: 1.2 C1.2 C2.2 C3.2 C4.2 C5.2 C6.2 C7.2 C8.2 C9.2 C10.2 C11.2 C12.2 C13.2 C14.2 C15.2 C16.2 C17.2 C18.2 C19.1 C20.1 C21.1 C22.2 C23.1 C24.2 C25.2 C26.2 C27.2 C28.2 C29.2 C50.2 IC1.14(VSS_1) IC1.22(VSS_2) IC1.37(VSSA) IC1.61(VSS_3) IC1.71(VSS_4) IC1.95(VSS_5) IC1.103(VSSDSI_1) IC1.109(VSSDSI_2) IC1.117(VSS_6) IC1.130(VSS_7) IC1.135(VSS_8) IC1.148(VSS_9) IC1.158(VSS_10) IC2.2 P2.3 Q1.2(E) R2.2
VDD: C1.1 C2.1 C3.1 C4.1 C5.1 C6.1 C7.1 C8.1 C9.1 C10.1 C11.1 C15.1 C16.1 C17.1 C18.1 C19.2 C20.2 IC1.15(VDD_1) IC1.23(VDD_2) IC1.36(VDD_3) IC1.49(VDD_4) IC1.62(VDD_5) IC1.72(VDD_6) IC1.82(VDD_7) IC1.96(VDD_8) IC1.99(VDDDSI) IC1.118(VDDUSB) IC1.131(VDD_9) IC1.136(VDD_10) IC1.149(VDDSDMMC) IC1.159(VDD_11) IC1.172(VDD_12) L1.2 P1.1
VDDA: C21.2 C22.1 C23.2 C24.1 IC1.38(VREF+) IC1.39(VDDA) L1.1  [also labelled VREF+]
ADC_BED: IC1.57(PB1) ; port ADC_BED
ADC_HE0: IC1.47(PA3) ; port ADC_HE0
ADC_HE1: IC1.51(PA5) ; port ADC_HE1
BOOT0: IC1.166(BOOT0) R2.1
BUZZER: IC1.132(PI0) R10.1
C_HREF: IC1.50(PA4) ; port C_HREF
C_PCLK: IC1.52(PA6) ; port C_PCLK
C_PWDN: IC1.111(PG3) ; port C_PWDN
C_SCL: IC1.45(PH4) ; port C_SCL
C_SDA: IC1.46(PH5) ; port C_SDA
C_VSYNC: IC1.152(PG9) ; port C_VSYNC
C_XCLK: IC1.123(PA8) ; port C_XCLK
CLKN: IC1.105(DSI_CKN) ; port CLKN
CLKP: IC1.104(DSI_CKP) ; port CLKP
D0N: IC1.102(DSI_D0N) ; port D0N
D0P: IC1.101(DSI_D0P) ; port D0P
D1N: IC1.108(DSI_D1N) ; port D1N
D1P: IC1.107(DSI_D1P) ; port D1P
DOUT0: IC1.124(PA9)
DOUT1: IC1.120(PC7)
DOUT2: IC1.153(PG10)
DOUT3: IC1.154(PG11)
DOUT4: IC1.3(PE4)
DOUT5: IC1.145(PD3)
DOUT6: IC1.4(PE5)
DOUT7: IC1.5(PE6)
DOUT8: IC1.133(PI1)
DOUT9: IC1.84(PH7)
E0_DIR: IC1.43(PH2) ; port E0_DIR  [project net DIR4]
E0_S: IC1.115(PG7) ; port E0_S
E0_STEP: IC1.13(PI11) ; port E0_STEP
E1_DIR: IC1.58(PB2) ; port E1_DIR  [project net DIR5]
E1_S: IC1.114(PG6) ; port E1_S
E1_STEP: IC1.44(PH3) ; port E1_STEP
ETH_CRS_DV: IC1.53(PA7) ; port ETH_CRS_DV
ETH_MDC: IC1.33(PC1) ; port ETH_MDC
ETH_MDIO: IC1.42(PA2) ; port ETH_MDIO
ETH_REFCLK: IC1.41(PA1) ; port ETH_REFCLK
ETH_RXD0: IC1.54(PC4) ; port ETH_RXD0
ETH_RXD1: IC1.55(PC5) ; port ETH_RXD1
ETH_TX_EN: IC1.80(PB11) ; port ETH_TX_EN
ETH_TXD0: IC1.85(PB12) ; port ETH_TXD0
ETH_TXD1: IC1.86(PB13) ; port ETH_TXD1
F_A0: IC1.16(PF0)
F_A1: IC1.17(PF1)
F_A2: IC1.18(PF2)
F_A3: IC1.19(PF3)
F_A4: IC1.20(PF4)
F_A5: IC1.21(PF5)
F_A6: IC1.60(PF12)
F_A7: IC1.63(PF13)
F_A8: IC1.64(PF14)
F_A9: IC1.65(PF15)
F_A10: IC1.66(PG0)
F_A11: IC1.67(PG1)
F_A12: IC1.110(PG2)
F_BA0: IC1.112(PG4) ; port F_BA0
F_BA1: IC1.113(PG5) ; port F_BA1
F_D0: IC1.97(PD14)
F_D1: IC1.98(PD15)
F_D2: IC1.142(PD0)
F_D3: IC1.143(PD1)
F_D4: IC1.68(PE7)
F_D5: IC1.69(PE8)
F_D6: IC1.70(PE9)
F_D7: IC1.73(PE10)
F_D8: IC1.74(PE11)
F_D9: IC1.75(PE12)
F_D10: IC1.76(PE13)
F_D11: IC1.77(PE14)
F_D12: IC1.78(PE15)
F_D13: IC1.89(PD8)
F_D14: IC1.90(PD9)
F_D15: IC1.91(PD10)
F_NBL0: IC1.169(PE0) ; port F_NBL0
F_NBL1: IC1.170(PE1) ; port F_NBL1
F_SDCLK: IC1.116(PG8) ; port F_SDCLK
F_SDNCAS: IC1.160(PG15) ; port F_SDNCAS
F_SDNCKE0: IC1.35(PC3) ; port F_SDNCKE0
F_SDNE0: IC1.34(PC2) ; port F_SDNE0
F_SDNRAS: IC1.59(PF11) ; port F_SDNRAS
F_SDNWE: IC1.32(PC0) ; port F_SDNWE
FAN_PWM: IC1.119(PC6) ; port FAN
FL_CS: IC1.79(PB10) ; port FL_CS  [project net CS]
FL_SCLK: IC1.28(PF10) ; port FL_SCLK
FL_SIO0: IC1.92(PD11)
FL_SIO1: IC1.93(PD12)
FL_SIO2: IC1.1(PE2)
FL_SIO3: IC1.94(PD13)
H_BEDI: IC1.26(PF8) ; port H_BEDI
H_FHE0I: IC1.163(PB5) ; port H_FHE0I
H_FHE1I: IC1.56(PB0) ; port H_FHE1I
H_HE0I: IC1.83(PH6) ; port H_HE0I
H_HE1I: IC1.88(PB15) ; port H_HE1I
H_NZLFI: IC1.27(PF9) ; port H_NZLFI
JTCK: IC1.137(PA14) P2.2 ; port JTCK
JTMS: IC1.128(PA13) P2.4 ; port JTMS
NRST: IC1.31(NRST) P2.5 R5.2 ; port NRST
OSC32_IN: IC1.9(PC14) R6.1
OSC32_OUT: IC1.10(PC15) R7.1
OSC_IN: IC1.29(PH0) R8.1
OSC_OUT: IC1.30(PH1) R9.1
PDR_ON: IC1.171(PDR_ON) R1.2
S_DIAG: IC1.168(PB9) ; port S_DIAG
S_ENN: IC1.162(PB4) ; port S_ENN
S_UART: IC1.40(PA0) ; port S_UART
SERVO: IC1.167(PB8) ; port SERVO
SL_S1: IC1.175(PI6) ; port SL_S1
SL_S2: IC1.174(PI5) ; port SL_S2
SL_S3: IC1.173(PI4) ; port SL_S3
SWO: IC1.161(PB3) ; port SWO
USART1_RX: IC1.125(PA10) ; port VCP_RX
USART1_TX: IC1.87(PB14) ; port VCP_TX
USB_N: IC1.126(PA11) ; port USB_N  [project net FS_DM_N]
USB_P: IC1.127(PA12) ; port USB_P  [project net FS_DM_P]
uSD_CLK: IC1.141(PC12) ; port uSD_CLK
uSD_CMD: IC1.144(PD2) ; port uSD_CMD
uSD_D0: IC1.121(PC8)
uSD_D1: IC1.122(PC9)
uSD_D2: IC1.139(PC10)
uSD_D3: IC1.140(PC11)
VBAT: IC1.6(VBAT) P1.2
VCAP_1: C25.1 IC1.81(VCAP_1)
VCAP_2: C26.1 IC1.129(VCAP_2)
WIFI_RX: IC1.138(PA15) ; port WIFI_RX
WIFI_TX: IC1.24(PF6) ; port WIFI_TX
X_DIR: IC1.2(PE3) ; port X_DIR  [project net DIR1]
X_STEP: IC1.176(PI7) ; port X_STEP  [project net STEP1]
X_STOP: IC1.157(PG14) ; port X_STOP
Y_DIR: IC1.8(PC13) ; port Y_DIR  [project net DIR2]
Y_STEP: IC1.7(PI8) ; port Y_STEP  [project net STEP2]
Y_STOP: IC1.156(PG13) ; port Y_STOP
Z-: IC1.155(PG12) ; port Z-
Z_DIR: IC1.12(PI10) ; port Z_DIR  [project net DIR3]
Z_STEP: IC1.11(PI9) ; port Z_STEP  [project net STEP3]
Net1_1: 1.1 IC1.48(BYPASS_REG)
NetC27_1: C27.1 R6.2 X1.1
NetC28_1: C28.1 R7.2 X1.2
NetC29_1: C29.1 R8.2 X2.1
NetC50_1: C50.1 R9.2 X2.2
NetIC2_1: IC2.1 P1.3
NetLS1_-: LS1.- Q1.3(C)
NetQ1_1: Q1.1(B) R10.2

Not connected (* = marked no-connect by the designer): IC1 25(PF7)* 134(PI3)* 146(PD4)* 147(PD5)* 150(PD6)* 151(PD7)* 164(PB6)* 165(PB7)*; P2 6*

### Buses and harness runs
bus DOUT[0..9] = port DOUT[0..9]
bus F_A[0..12] = port F_A[0..12]
bus F_D[0..15] = port F_D[0..15]
bus FL_SIO[0..3] = port FL_SIO[0..3]
bus uSD_D[0..3] = port uSD_D[0..3]

### Layout directives
differential pair: FS_DM_N, FS_DM_P

### Library data of the parts
1 R1 R2 R5-R10 = Res1: Resistor; Published: 8-Jun-2000; LatestRevisionDate: 17-Jul-2002; LatestRevisionNote: Re-released for DXP Platform.; PackageReference: AXIAL-0.3; Publisher: Altium Limited; PackageDescription: Axial Device, Thru-Hole; 2 Leads; 0.3 in Pin Spacing
C1-C18 C22 C24-C29 C50 = Cap: Capacitor; Published: 8-Jun-2000; LatestRevisionDate: 17-Jul-2002; LatestRevisionNote: Re-released for DXP Platform.; PackageReference: RAD-0.3; Publisher: Altium Limited; PackageDescription: Radial Cap, Thru-Hole; 2 Leads; 0.3 in Pin Spacing
C19 C20 = GRM185R61C475KE11D: CAP CER 4.7UF 16V X5R 0603; manufacturer: Murata Electronics; Tolerance: ±10%; Part Number: GRM185R61C475KE11D; Value: 4.7 µF; Applications: General Purpose; Capacitance: 4.7 µF; componentlink1description: Datasheet; componentlink1url: https://search.murata.co.jp/Ceramy/image/img/A01X/G101/ENG/GRM185R61C475KE11-01.pdf; componentlink2description: DigiKey Link; componentlink2url: https://www.digikey.com/en/products/detail/murata-electronics/GRM185R61C475KE11D/6606088; Device Package: 0603 (1608 Metric); lastupdated: 3/28/2023 7:09:04 PM; Lifecycle Status: Active; Minimum Order: 1; Mounting Type: Surface Mount, MLCC; Operating Temperature: -55°C ~ 85°C; Package / Case: 0603 (1608 Metric); packaging: TapeAndReel; partid: 2451; Part Status: Active; price: 0.05; series: GRM; Size / Dimension: 0.063" L x 0.031" W (1.60mm x 0.80mm); Supplier 1: DigiKey; Supplier Part Number 1: 490-14459-1-ND; Temperature Coefficient: X5R; Thickness (Max): 0.022" (0.55mm); Voltage - Rated: 16V
C21 C23 = 0603YD105KAT4A: CAP CER 1UF 16V X5R 0603; manufacturer: AVX Corporation; Tolerance: ±10%; Part Number: 0603YD105KAT4A; Value: 1µF; Applications: General Purpose; Capacitance: 1µF; componentlink1description: Datasheet; componentlink1url: http://datasheets.avx.com/cx5r.pdf; componentlink2description: DigiKey Link; componentlink2url: http://digikey.com/product-detail/en/avx-corporation/0603YD105KAT4A/478-10365-1-ND/6797443; Device Package: 0603 (1608 Metric); lastupdated: 9/2/2020 1:03:10 AM; Lifecycle Status: Active; Minimum Order: 1; Mounting Type: Surface Mount, MLCC; Operating Temperature: -55°C ~ 85°C; Package / Case: 0603 (1608 Metric); packaging: TapeAndReel; partid: 15257; Part Status: Active; price: 0.03; series: -; Size / Dimension: 0.063" L x 0.032" W (1.60mm x 0.81mm); Supplier 1: DigiKey; Supplier Part Number 1: 478-10365-1-ND; Temperature Coefficient: X5R; Thickness (Max): 0.035" (0.90mm); Voltage - Rated: 16V
IC1 = STM32F779IIT6: Integrated Circuit; Manufacturer_Name: STMicroelectronics; Datasheet Link: https://www.arrow.com/en/products/stm32f779iit6/stmicroelectronics; Height: 1.6mm; Manufacturer_Part_Number: STM32F779IIT6; Mouser Part Number: 511-STM32F779IIT6; Mouser Price/Stock: https://www.mouser.co.uk/ProductDetail/STMicroelectronics/STM32F779IIT6?qs=qzCNEk%252BRr%252BabClKc4EG9PA%3D%3D; Arrow Part Number: STM32F779IIT6; Arrow Price/Stock: https://www.arrow.com/en/products/stm32f779iit6/stmicroelectronics?region=nac
IC2 = CR1220-H-SMD: Integrated Circuit; Manufacturer_Name: ROBOTIS; Datasheet Link: https://www.robotics.org.za/CR1220-H-SMD; Height: 4.1mm; Manufacturer_Part_Number: CR1220-H-SMD
L1 = Inductor: Value: 100uH; Published: 8-Jun-2000; Revision: July-2002: Re-released for DXP Platform.; Publisher: Altium Limited
LS1 = SMT-0827-S-2-R: AUDIO MAGNETIC XDCR 2.5-4.5V SMD; Manufacturer: PUI Audio, Inc.; Current - Supply: 90mA; Driver Circuitry: Transducer, Externally Driven; Frequency: 2.7kHz; Input Type: Zero-Peak Signal; Operating Mode: Single Tone; Port Location: Side; Sound Pressure Level (SPL): 92dB @ 3.6V, 10cm; Voltage Range: 2.5 ~ 4.5V; Voltage - Rated: 3.6V; Part Number: SMT-0827-S-2-R; ComponentLink1Description: Datasheet; ComponentLink1URL: http://www.puiaudio.com/pdf/SMT-0827-S-2-R.pdf; ComponentLink2Description: DigiKey Link; ComponentLink2URL: http://digikey.com/product-detail/en/pui-audio-inc/SMT-0827-S-2-R/668-1072-1-ND/1464939; Height - Seated (Max): 0.177" (4.50mm); LastUpdated: 4/24/2020 12:38:09 AM; Lifecycle Status: Active; Minimum Order: 1; Mounting Type: Surface Mount; Operating Temperature: -30°C ~ 70°C; Packaging: TapeAndReel; Part Status: Active; Price: 2.03; Series: SMT; Size / Dimension: 0.335" L x 0.335" W (8.50mm x 8.50mm); Supplier 1: DigiKey; Supplier Part Number 1: 668-1072-1-ND; Technology: Magnetic; Termination: Solder Pads
P1 = Header 3: Header, 3-Pin; LatestRevisionDate: 17-Jul-2002; LatestRevisionNote: Re-released for DXP Platform.; Publisher: Altium Limited
P2 = Header 6: Header, 6-Pin; LatestRevisionDate: 17-Jul-2002; LatestRevisionNote: Re-released for DXP Platform.; Publisher: Altium Limited
Q1 = MMBT3904TT1G: TRANS NPN 40V 0.2A SOT416; Manufacturer: ON Semiconductor; Current - Collector (Ic) (Max): 200mA; DC Current Gain (hFE) (Min) @ Ic, Vce: 100 @ 10mA, 1V; Frequency - Transition: 300MHz; Power - Max: 300mW; Vce Saturation (Max) @ Ib, Ic: 300mV @ 5mA, 50mA; Part Number: MMBT3904TT1G; ComponentLink1Description: Datasheet; ComponentLink1URL: https://www.onsemi.com/pub/Collateral/MMBT3904TT1-D.PDF; ComponentLink2Description: DigiKey Link; ComponentLink2URL: http://digikey.com/product-detail/en/on-semiconductor/MMBT3904TT1G/MMBT3904TT1GOSCT-ND/1139815; LastUpdated: 2/1/2023 9:06:25 PM; Lifecycle Status: Active; Minimum Order: 1; Mounting Type: Surface Mount; Operating Temperature: -55°C ~ 150°C (TJ); Package / Case: SC-75, SOT-416; Packaging: TapeAndReel; PartId: 34; Part Status: Active; Price: 0.02; Series: -; Supplier 1: DigiKey; Supplier Part Number 1: MMBT3904TT1GOSCT-ND; Supplier Device Package: SC-75, SOT-416; Transistor Type: NPN; Voltage - Collector Emitter Breakdown (Max): 40V
X1 = NX5032GA-25.000000MHZ-LN-CD-1: CRYSTAL 25.0000MHZ 8PF SMD; Manufacturer: NDK America, Inc.; ESR (Equivalent Series Resistance): 70 Ohms; Frequency: 25 MHz; Frequency Stability: ±50ppm; Operating Mode: Fundamental; Value: 25 MHz; Part Number: NX5032GA-25.000000MHZ-LN-CD-1; ComponentLink1Description: Datasheet; ComponentLink1URL: //media.digikey.com/pdf/Data%20Sheets/NDK%20PDFs/NX5032GA.pdf; ComponentLink2Description: DigiKey Link; ComponentLink2URL: https://www.digikey.com/en/products/detail/ndk-america-inc/NX5032GA-25-000000MHZ-LN-CD-1/1128823; Frequency Tolerance: ±50ppm; Height - Seated (Max): 0.059" (1.50mm); LastUpdated: 3/28/2023 8:00:45 PM; Lifecycle Status: Active; Load Capacitance: 8pF; Minimum Order: 1; Mounting Type: Surface Mount; Operating Temperature: -10°C ~ 70°C; Package / Case: 2-SMD, No Lead; Packaging: TapeAndReel; PartId: 621; Part Status: Active; Price: 0.28; Series: NX5032GA; Size / Dimension: 0.197" L x 0.126" W (5.00mm x 3.20mm); Supplier 1: DigiKey; Supplier Part Number 1: 644-1041-1-ND; Type: MHz Crystal
X2 = NX5032GA-25.000000MHZ-LN-CD-1: CRYSTAL 25.0000MHZ 8PF SMD; Manufacturer: NDK America, Inc.; ESR (Equivalent Series Resistance): 70 Ohms; Frequency Stability: ±50ppm; Operating Mode: Fundamental; Part Number: NX5032GA-25.000000MHZ-LN-CD-1; ComponentLink1Description: Datasheet; ComponentLink1URL: //media.digikey.com/pdf/Data%20Sheets/NDK%20PDFs/NX5032GA.pdf; ComponentLink2Description: DigiKey Link; ComponentLink2URL: https://www.digikey.com/en/products/detail/ndk-america-inc/NX5032GA-25-000000MHZ-LN-CD-1/1128823; Frequency: 25 MHz; Frequency Tolerance: ±50ppm; Height - Seated (Max): 0.059" (1.50mm); LastUpdated: 3/28/2023 8:00:45 PM; Lifecycle Status: Active; Load Capacitance: 8pF; Minimum Order: 1; Mounting Type: Surface Mount; Operating Temperature: -10°C ~ 70°C; Package / Case: 2-SMD, No Lead; Packaging: TapeAndReel; PartId: 621; Part Status: Active; Price: 0.28; Series: NX5032GA; Size / Dimension: 0.197" L x 0.126" W (5.00mm x 3.20mm); Supplier 1: DigiKey; Supplier Part Number 1: 644-1041-1-ND; Type: MHz Crystal; Value: 25 MHz

## Sheet SDRAM.SchDoc
size B
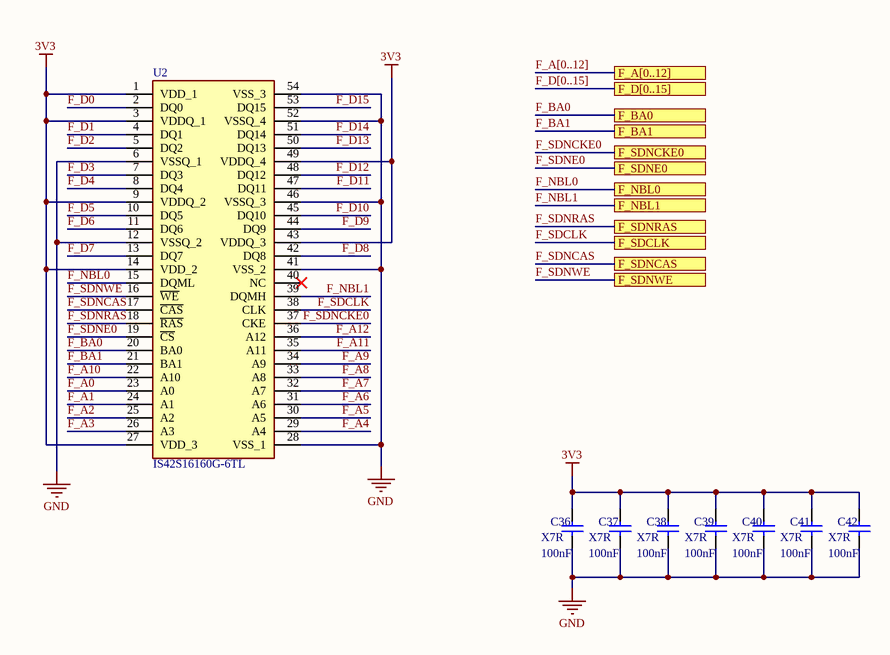
[diagram p3: SDRAM.SchDoc]

### Parts
C36  X7R  value 100nF  [1608[0603]]
C37  X7R  value 100nF  [1608[0603]]
C38  X7R  value 100nF  [1608[0603]]
C39  X7R  value 100nF  [1608[0603]]
C40  X7R  value 100nF  [1608[0603]]
C41  X7R  value 100nF  [1608[0603]]
C42  X7R  value 100nF  [1608[0603]]
U2  IS42S16160G-6TL  [SOP80P1176X120-54N]

### Ports
F_A[0..12], F_BA0, F_BA1, F_D[0..15], F_NBL0, F_NBL1, F_SDCLK, F_SDNCAS, F_SDNCKE0, F_SDNE0, F_SDNRAS, F_SDNWE

### Nets
3V3: C36.2 C37.2 C38.2 C39.2 C40.2 C41.2 C42.2 U2.1(VDD_1) U2.3(VDDQ_1) U2.9(VDDQ_2) U2.14(VDD_2) U2.27(VDD_3) U2.43(VDDQ_3) U2.49(VDDQ_4)
GND: C36.1 C37.1 C38.1 C39.1 C40.1 C41.1 C42.1 U2.6(VSSQ_1) U2.12(VSSQ_2) U2.28(VSS_1) U2.41(VSS_2) U2.46(VSSQ_3) U2.52(VSSQ_4) U2.54(VSS_3)
F_A0: U2.23(A0)
F_A1: U2.24(A1)
F_A2: U2.25(A2)
F_A3: U2.26(A3)
F_A4: U2.29(A4)
F_A5: U2.30(A5)
F_A6: U2.31(A6)
F_A7: U2.32(A7)
F_A8: U2.33(A8)
F_A9: U2.34(A9)
F_A10: U2.22(A10)
F_A11: U2.35(A11)
F_A12: U2.36(A12)
F_BA0: U2.20(BA0) ; port F_BA0
F_BA1: U2.21(BA1) ; port F_BA1
F_D0: U2.2(DQ0)
F_D1: U2.4(DQ1)
F_D2: U2.5(DQ2)
F_D3: U2.7(DQ3)
F_D4: U2.8(DQ4)
F_D5: U2.10(DQ5)
F_D6: U2.11(DQ6)
F_D7: U2.13(DQ7)
F_D8: U2.42(DQ8)
F_D9: U2.44(DQ9)
F_D10: U2.45(DQ10)
F_D11: U2.47(DQ11)
F_D12: U2.48(DQ12)
F_D13: U2.50(DQ13)
F_D14: U2.51(DQ14)
F_D15: U2.53(DQ15)
F_NBL0: U2.15(DQML) ; port F_NBL0
F_NBL1: U2.39(DQMH) ; port F_NBL1
F_SDCLK: U2.38(CLK) ; port F_SDCLK
F_SDNCAS: U2.17(~{CAS}) ; port F_SDNCAS
F_SDNCKE0: U2.37(CKE) ; port F_SDNCKE0
F_SDNE0: U2.19(~{CS}) ; port F_SDNE0
F_SDNRAS: U2.18(~{RAS}) ; port F_SDNRAS
F_SDNWE: U2.16(~{WE}) ; port F_SDNWE

Not connected (* = marked no-connect by the designer): U2 40(NC)*

### Buses and harness runs
bus F_A[0..12] = port F_A[0..12]
bus F_D[0..15] = port F_D[0..15]

### Library data of the parts
C36-C42 = Cap: Capacitor; Published: 8-Jun-2000; LatestRevisionDate: 17-Jul-2002; LatestRevisionNote: Re-released for DXP Platform.; PackageReference: RAD-0.3; Publisher: Altium Limited; PackageDescription: Radial Cap, Thru-Hole; 2 Leads; 0.3 in Pin Spacing
U2 = IS42S16160G-6TL: Integrated Circuit; Manufacturer_Name: Integrated Silicon Solution Inc.; Datasheet Link: http://www.issi.com/WW/pdf/42-45S83200G-16160G.pdf; Height: 1.2mm; Manufacturer_Part_Number: IS42S16160G-6TL; Mouser Part Number: 870-IS42S16160G-6TL; Mouser Price/Stock: https://www.mouser.co.uk/ProductDetail/ISSI/IS42S16160G-6TL?qs=9hm%252BDT1Jr7z36E7PiUiieg%3D%3D; Arrow Part Number: IS42S16160G-6TL; Arrow Price/Stock: https://www.arrow.com/en/products/is42s16160g-6tl/integrated-silicon-solution-inc

## Sheet Flash.SchDoc
size B
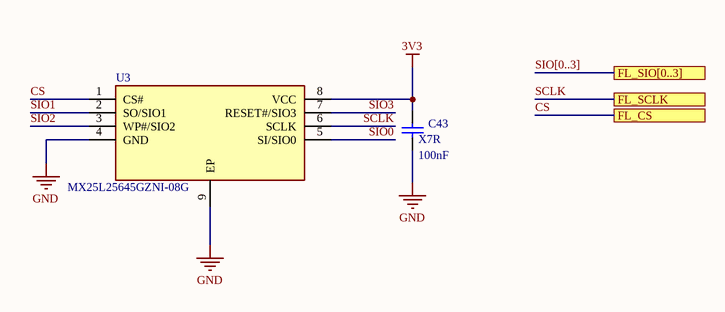
[diagram p4: Flash.SchDoc]

### Parts
C43  X7R  value 100nF  [1608[0603]]
U3  MX25L25645GZNI-08G  [SON127P600X500X80-9N-D]

### Ports
FL_CS, FL_SCLK, FL_SIO[0..3]

### Nets
3V3: C43.2 U3.8(VCC)
GND: C43.1 U3.4(GND) U3.9(EP)
CS: U3.1(CS#) ; port FL_CS
SCLK: U3.6(SCLK) ; port FL_SCLK  [project net FL_SCLK]
SIO0: U3.5(SI/SIO0)  [project net FL_SIO0]
SIO1: U3.2(SO/SIO1)  [project net FL_SIO1]
SIO2: U3.3(WP#/SIO2)  [project net FL_SIO2]
SIO3: U3.7(RESET#/SIO3)  [project net FL_SIO3]

### Buses and harness runs
bus SIO[0..3] = port FL_SIO[0..3]

### Library data of the parts
C43 = Cap: Capacitor; Published: 8-Jun-2000; LatestRevisionDate: 17-Jul-2002; LatestRevisionNote: Re-released for DXP Platform.; PackageReference: RAD-0.3; Publisher: Altium Limited; PackageDescription: Radial Cap, Thru-Hole; 2 Leads; 0.3 in Pin Spacing
U3 = MX25L25645GZNI-08G: Integrated Circuit; Manufacturer_Name: Macronix; Datasheet Link: https://www.macronix.com/Lists/Datasheet/Attachments/7858/MX25L25645G,%203V,%20256Mb,%20v1.9.pdf; Height: 0.8mm; Manufacturer_Part_Number: MX25L25645GZNI-08G; Arrow Part Number: MX25L25645GZNI-08G; Arrow Price/Stock: https://www.arrow.com/en/products/mx25l25645gzni-08g/macronix-international?region=nac

## Sheet ADCRead.SchDoc
size B
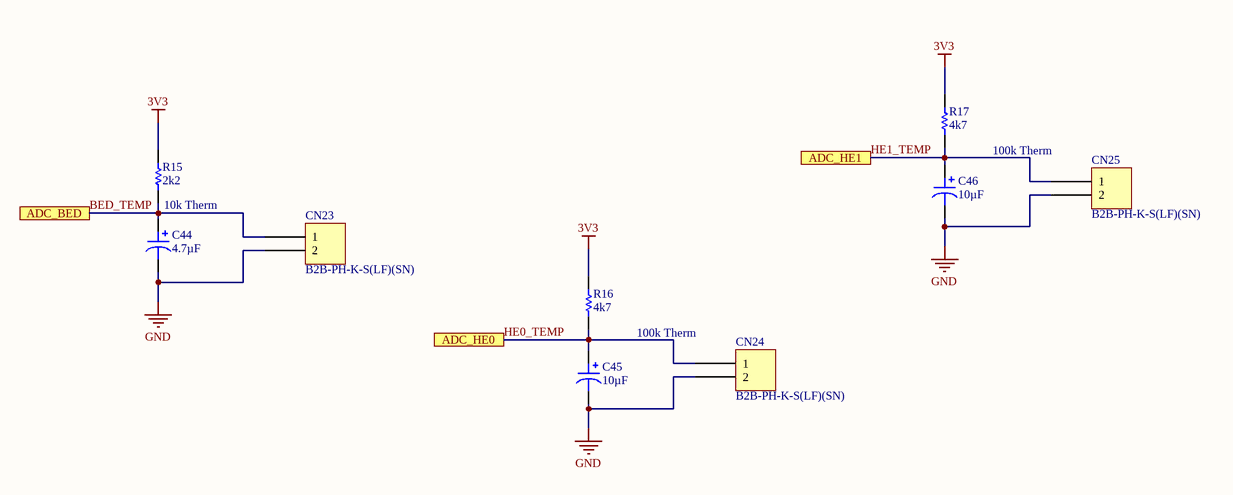
[diagram p5: ADCRead.SchDoc]

### Parts
C44  4.7µF  [CAP ALSMD POLY 4.3MM H5.5MM]
C45  10µF  [CAP ALSMD 5.3MM H5.4MM]
C46  10µF  [CAP ALSMD 5.3MM H5.4MM]
CN23  B2B-PH-K-S(LF)(SN)  [JST B2B-PH-K]
CN24  B2B-PH-K-S(LF)(SN)  [JST B2B-PH-K]
CN25  B2B-PH-K-S(LF)(SN)  [JST B2B-PH-K]
R15  value 2k2  [1608[0603]]  (hidden comment: Res1)
R16  value 4k7  [1608[0603]]  (hidden comment: Res1)
R17  value 4k7  [1608[0603]]  (hidden comment: Res1)

### Ports
ADC_BED, ADC_HE0, ADC_HE1

### Nets
3V3: R15.1 R16.1 R17.1
GND: C44.2 C45.2 C46.2 CN23.2 CN24.2 CN25.2
BED_TEMP: C44.1 CN23.1 R15.2 ; port ADC_BED  [project net ADC_BED]
HE0_TEMP: C45.1 CN24.1 R16.2 ; port ADC_HE0  [project net ADC_HE0]
HE1_TEMP: C46.1 CN25.1 R17.2 ; port ADC_HE1  [project net ADC_HE1]

### Notes on the sheet
- 100k Therm
- 10k Therm

### Library data of the parts
C44 = PCF1A4R7MCL1GB: CAP ALUM POLY 4.7UF 20% 10V SMD; manufacturer: Nichicon; ESR (Equivalent Series Resistance): 240mOhm; Lifetime @ Temp.: 2000 Hrs @ 105°C; Ripple Current @ High Frequency: 670mA @ 100kHz; Surface Mount Land Size: 0.169" L x 0.169" W (4.30mm x 4.30mm); Type: Polymer; Part Number: PCF1A4R7MCL1GB; Applications: General Purpose; Capacitance: 4.7µF; componentlink1description: Datasheet; componentlink1url: http://nichicon-us.com/english/products/pdfs/e-pcf.pdf; componentlink2description: DigiKey Link; componentlink2url: http://digikey.com/product-detail/en/nichicon/PCF1A4R7MCL1GB/493-14005-1-ND/5180801; Device Package: Radial, Can - SMD; Height - Seated (Max): 0.217" (5.50mm); lastupdated: 9/2/2020 1:22:02 AM; Lifecycle Status: Active; Minimum Order: 1; Mounting Type: Surface Mount; Operating Temperature: -55°C ~ 105°C; Package / Case: Radial, Can - SMD; packaging: TapeAndReel; partid: 1859; Part Status: Active; price: 0.36; series: PCF; Size / Dimension: 0.157" Dia (4.00mm); Supplier 1: DigiKey; Supplier Part Number 1: 493-14005-1-ND; Tolerance: ±20%; value: 4.7µF; Voltage - Rated: 10V
C45 C46 = UZP1C100MCL1GB: CAP ALUM 10UF 20% 16V SMD; manufacturer: Nichicon; Lifetime @ Temp.: 2000 Hrs @ 85°C; Polarization: Bi-Polar; Ripple Current @ High Frequency: 34.5mA @ 10kHz; Ripple Current @ Low Frequency: 23mA @ 120Hz; Surface Mount Land Size: 0.209" L x 0.209" W (5.30mm x 5.30mm); Part Number: UZP1C100MCL1GB; Applications: General Purpose; Capacitance: 10µF; componentlink1description: Datasheet; componentlink1url: //media.digikey.com/pdf/Data%20Sheets/Nichicon%20PDFs/ZP_Series.pdf; componentlink2description: DigiKey Link; componentlink2url: http://digikey.com/product-detail/en/nichicon/UZP1C100MCL1GB/493-10077-1-ND/3983922; Device Package: Radial, Can - SMD; Height - Seated (Max): 0.181" (4.60mm); lastupdated: 9/2/2020 1:18:30 AM; Lifecycle Status: Active; Minimum Order: 1; Mounting Type: Surface Mount; Operating Temperature: -40°C ~ 85°C; Package / Case: Radial, Can - SMD; packaging: TapeAndReel; partid: 8608; Part Status: Active; price: 0.21; series: UZP; Size / Dimension: 0.197" Dia (5.00mm); Supplier 1: DigiKey; Supplier Part Number 1: 493-10077-1-ND; Tolerance: ±20%; value: 10µF; Voltage - Rated: 16V
CN23-CN25 = B2B-PH-K-S(LF)(SN): CONN HEADER VERT 2POS 2MM; Manufacturer: JST Sales America Inc.; Contact Length - Mating: 0.130" (3.30mm); Contact Length - Post: 0.134" (3.40mm); Current Rating (Amps): 2A; Material Flammability Rating: UL94 V-0; Number of Positions: 2; Number of Positions Loaded: All; Overall Contact Length: 0.333" (8.45mm); Pitch - Mating: 0.079" (2.00mm); Shrouding: Shrouded - 4 Wall; Style: Board to Cable/Wire; Voltage Rating: 100V; Part Number: B2B-PH-K-S(LF)(SN); ComponentLink1Description: Datasheet; ComponentLink1URL: http://www.jst-mfg.com/product/pdf/eng/ePH.pdf; ComponentLink2Description: DigiKey Link; ComponentLink2URL: http://digikey.com/product-detail/en/jst-sales-america-inc/B2B-PH-K-S-LF-SN/455-1704-ND/926611; Connector Type: Header; Contact Finish - Mating: Tin; Contact Finish - Post: Tin; Contact Material: Brass; Contact Shape: Square; Contact Type: Male Pin; Fastening Type: Detent Lock; Insulation Color: Natural; Insulation Height: 0.236" (6.00mm); Insulation Material: Polyamide (PA66), Nylon 6/6; LastUpdated: 1/3/2020 11:40:58 PM; Lifecycle Status: Active; Minimum Order: 1; Mounting Type: Through Hole; Number of Rows: 1; Operating Temperature: -25°C ~ 85°C; Packaging: Bulk; PartId: 11; Part Status: Active; Price: 0.17; Series: PH; Supplier 1: DigiKey; Supplier Part Number 1: 455-1704-ND; Termination: Press-Fit, Solder
R15-R17 = Res1: Resistor; Published: 8-Jun-2000; LatestRevisionDate: 17-Jul-2002; LatestRevisionNote: Re-released for DXP Platform.; PackageReference: AXIAL-0.3; Publisher: Altium Limited; PackageDescription: Axial Device, Thru-Hole; 2 Leads; 0.3 in Pin Spacing

## Nets that join several sheets
3V3: Connectors (13 pins), STM32F7 (LS1.+ P2.1 R1.1 R5.1), SDRAM (14 pins), Flash (C43.2 U3.8), ADCRead (R15.1 R16.1 R17.1)
GND: Connectors (34 pins), STM32F7 (48 pins), SDRAM (14 pins), Flash (C43.1 U3.4 U3.9), ADCRead (6 pins)
ADC_BED: STM32F7 (IC1.57), ADCRead (C44.1 CN23.1 R15.2)
ADC_HE0: STM32F7 (IC1.47), ADCRead (C45.1 CN24.1 R16.2)
ADC_HE1: STM32F7 (IC1.51), ADCRead (C46.1 CN25.1 R17.2)
C_HREF: Connectors (CN1.6), STM32F7 (IC1.50)
C_PCLK: Connectors (CN1.7), STM32F7 (IC1.52)
C_PWDN: Connectors (CN1.17), STM32F7 (IC1.111)
C_SCL: Connectors (CN1.3), STM32F7 (IC1.45)
C_SDA: Connectors (CN1.4), STM32F7 (IC1.46)
C_VSYNC: Connectors (CN1.5), STM32F7 (IC1.152)
C_XCLK: Connectors (CN1.8), STM32F7 (IC1.123)
CLKN: Connectors (J1.5), STM32F7 (IC1.105)
CLKP: Connectors (J1.6), STM32F7 (IC1.104)
CS: STM32F7 (IC1.79), Flash (U3.1)
D0N: Connectors (J1.8), STM32F7 (IC1.102)
D0P: Connectors (J1.9), STM32F7 (IC1.101)
D1N: Connectors (J1.2), STM32F7 (IC1.108)
D1P: Connectors (J1.3), STM32F7 (IC1.107)
DIR1: Connectors (CN2.10), STM32F7 (IC1.2)
DIR2: Connectors (CN2.12), STM32F7 (IC1.8)
DIR3: Connectors (CN2.14), STM32F7 (IC1.12)
DIR4: Connectors (CN2.16), STM32F7 (IC1.43)
DIR5: Connectors (CN2.18), STM32F7 (IC1.58)
DOUT0: Connectors (CN1.20), STM32F7 (IC1.124)
DOUT1: Connectors (CN1.19), STM32F7 (IC1.120)
DOUT2: Connectors (CN1.16), STM32F7 (IC1.153)
DOUT3: Connectors (CN1.15), STM32F7 (IC1.154)
DOUT4: Connectors (CN1.14), STM32F7 (IC1.3)
DOUT5: Connectors (CN1.13), STM32F7 (IC1.145)
DOUT6: Connectors (CN1.12), STM32F7 (IC1.4)
DOUT7: Connectors (CN1.11), STM32F7 (IC1.5)
DOUT8: Connectors (CN1.10), STM32F7 (IC1.133)
DOUT9: Connectors (CN1.9), STM32F7 (IC1.84)
E0_S: Connectors (CN21.3), STM32F7 (IC1.115)
E0_STEP: Connectors (CN2.15), STM32F7 (IC1.13)
E1_S: Connectors (CN22.3), STM32F7 (IC1.114)
E1_STEP: Connectors (CN2.17), STM32F7 (IC1.44)
ETH_CRS_DV: Connectors (CN18.25), STM32F7 (IC1.53)
ETH_MDC: Connectors (CN18.23), STM32F7 (IC1.33)
ETH_MDIO: Connectors (CN18.24), STM32F7 (IC1.42)
ETH_REFCLK: Connectors (CN18.22), STM32F7 (IC1.41)
ETH_RXD0: Connectors (CN18.27), STM32F7 (IC1.54)
ETH_RXD1: Connectors (CN18.26), STM32F7 (IC1.55)
ETH_TX_EN: Connectors (CN18.21), STM32F7 (IC1.80)
ETH_TXD0: Connectors (CN18.20), STM32F7 (IC1.85)
ETH_TXD1: Connectors (CN18.19), STM32F7 (IC1.86)
F_A0: STM32F7 (IC1.16), SDRAM (U2.23)
F_A1: STM32F7 (IC1.17), SDRAM (U2.24)
F_A2: STM32F7 (IC1.18), SDRAM (U2.25)
F_A3: STM32F7 (IC1.19), SDRAM (U2.26)
F_A4: STM32F7 (IC1.20), SDRAM (U2.29)
F_A5: STM32F7 (IC1.21), SDRAM (U2.30)
F_A6: STM32F7 (IC1.60), SDRAM (U2.31)
F_A7: STM32F7 (IC1.63), SDRAM (U2.32)
F_A8: STM32F7 (IC1.64), SDRAM (U2.33)
F_A9: STM32F7 (IC1.65), SDRAM (U2.34)
F_A10: STM32F7 (IC1.66), SDRAM (U2.22)
F_A11: STM32F7 (IC1.67), SDRAM (U2.35)
F_A12: STM32F7 (IC1.110), SDRAM (U2.36)
F_BA0: STM32F7 (IC1.112), SDRAM (U2.20)
F_BA1: STM32F7 (IC1.113), SDRAM (U2.21)
F_D0: STM32F7 (IC1.97), SDRAM (U2.2)
F_D1: STM32F7 (IC1.98), SDRAM (U2.4)
F_D2: STM32F7 (IC1.142), SDRAM (U2.5)
F_D3: STM32F7 (IC1.143), SDRAM (U2.7)
F_D4: STM32F7 (IC1.68), SDRAM (U2.8)
F_D5: STM32F7 (IC1.69), SDRAM (U2.10)
F_D6: STM32F7 (IC1.70), SDRAM (U2.11)
F_D7: STM32F7 (IC1.73), SDRAM (U2.13)
F_D8: STM32F7 (IC1.74), SDRAM (U2.42)
F_D9: STM32F7 (IC1.75), SDRAM (U2.44)
F_D10: STM32F7 (IC1.76), SDRAM (U2.45)
F_D11: STM32F7 (IC1.77), SDRAM (U2.47)
F_D12: STM32F7 (IC1.78), SDRAM (U2.48)
F_D13: STM32F7 (IC1.89), SDRAM (U2.50)
F_D14: STM32F7 (IC1.90), SDRAM (U2.51)
F_D15: STM32F7 (IC1.91), SDRAM (U2.53)
F_NBL0: STM32F7 (IC1.169), SDRAM (U2.15)
F_NBL1: STM32F7 (IC1.170), SDRAM (U2.39)
F_SDCLK: STM32F7 (IC1.116), SDRAM (U2.38)
F_SDNCAS: STM32F7 (IC1.160), SDRAM (U2.17)
F_SDNCKE0: STM32F7 (IC1.35), SDRAM (U2.37)
F_SDNE0: STM32F7 (IC1.34), SDRAM (U2.19)
F_SDNRAS: STM32F7 (IC1.59), SDRAM (U2.18)
F_SDNWE: STM32F7 (IC1.32), SDRAM (U2.16)
FAN_PWM: Connectors (CN2.2), STM32F7 (IC1.119)
FL_SCLK: STM32F7 (IC1.28), Flash (U3.6)
FL_SIO0: STM32F7 (IC1.92), Flash (U3.5)
FL_SIO1: STM32F7 (IC1.93), Flash (U3.2)
FL_SIO2: STM32F7 (IC1.1), Flash (U3.3)
FL_SIO3: STM32F7 (IC1.94), Flash (U3.7)
FS_DM_N: Connectors (CN18.16), STM32F7 (IC1.126)
FS_DM_P: Connectors (CN18.17), STM32F7 (IC1.127)
H_BEDI: Connectors (CN2.7), STM32F7 (IC1.26)
H_FHE0I: Connectors (CN2.3), STM32F7 (IC1.163)
H_FHE1I: Connectors (CN2.4), STM32F7 (IC1.56)
H_HE0I: Connectors (CN2.5), STM32F7 (IC1.83)
H_HE1I: Connectors (CN2.6), STM32F7 (IC1.88)
H_NZLFI: Connectors (CN2.1), STM32F7 (IC1.27)
JTCK: Connectors (CN18.4), STM32F7 (IC1.137 P2.2)
JTMS: Connectors (CN18.3), STM32F7 (IC1.128 P2.4)
NRST: Connectors (CN18.5), STM32F7 (IC1.31 P2.5 R5.2)
S_DIAG: Connectors (CN2.25), STM32F7 (IC1.168)
S_ENN: Connectors (CN2.24), STM32F7 (IC1.162)
S_UART: Connectors (CN2.20), STM32F7 (IC1.40)
SERVO: Connectors (CN17.3), STM32F7 (IC1.167)
SL_S1: Connectors (CN2.23), STM32F7 (IC1.175)
SL_S2: Connectors (CN2.22), STM32F7 (IC1.174)
SL_S3: Connectors (CN2.21), STM32F7 (IC1.173)
STEP1: Connectors (CN2.9), STM32F7 (IC1.176)
STEP2: Connectors (CN2.11), STM32F7 (IC1.7)
STEP3: Connectors (CN2.13), STM32F7 (IC1.11)
SWO: Connectors (CN18.6), STM32F7 (IC1.161)
USART1_RX: Connectors (CN18.2), STM32F7 (IC1.125)
USART1_TX: Connectors (CN18.1), STM32F7 (IC1.87)
uSD_CLK: Connectors (CN18.12), STM32F7 (IC1.141)
uSD_CMD: Connectors (CN18.11), STM32F7 (IC1.144)
uSD_D0: Connectors (CN18.13), STM32F7 (IC1.121)
uSD_D1: Connectors (CN18.14), STM32F7 (IC1.122)
uSD_D2: Connectors (CN18.9), STM32F7 (IC1.139)
uSD_D3: Connectors (CN18.10), STM32F7 (IC1.140)
WIFI_RX: Connectors (CN18.30), STM32F7 (IC1.138)
WIFI_TX: Connectors (CN18.29), STM32F7 (IC1.24)
X_STOP: Connectors (C33.1 CN19.3 D1.2 R11.2), STM32F7 (IC1.157)
Y_STOP: Connectors (C34.1 CN16.3 D2.2 R13.2), STM32F7 (IC1.156)
Z-: Connectors (CN17.5), STM32F7 (IC1.155)